# EAGLE design ESC Arduino Perm (1) (EAGLE 7.6.0)
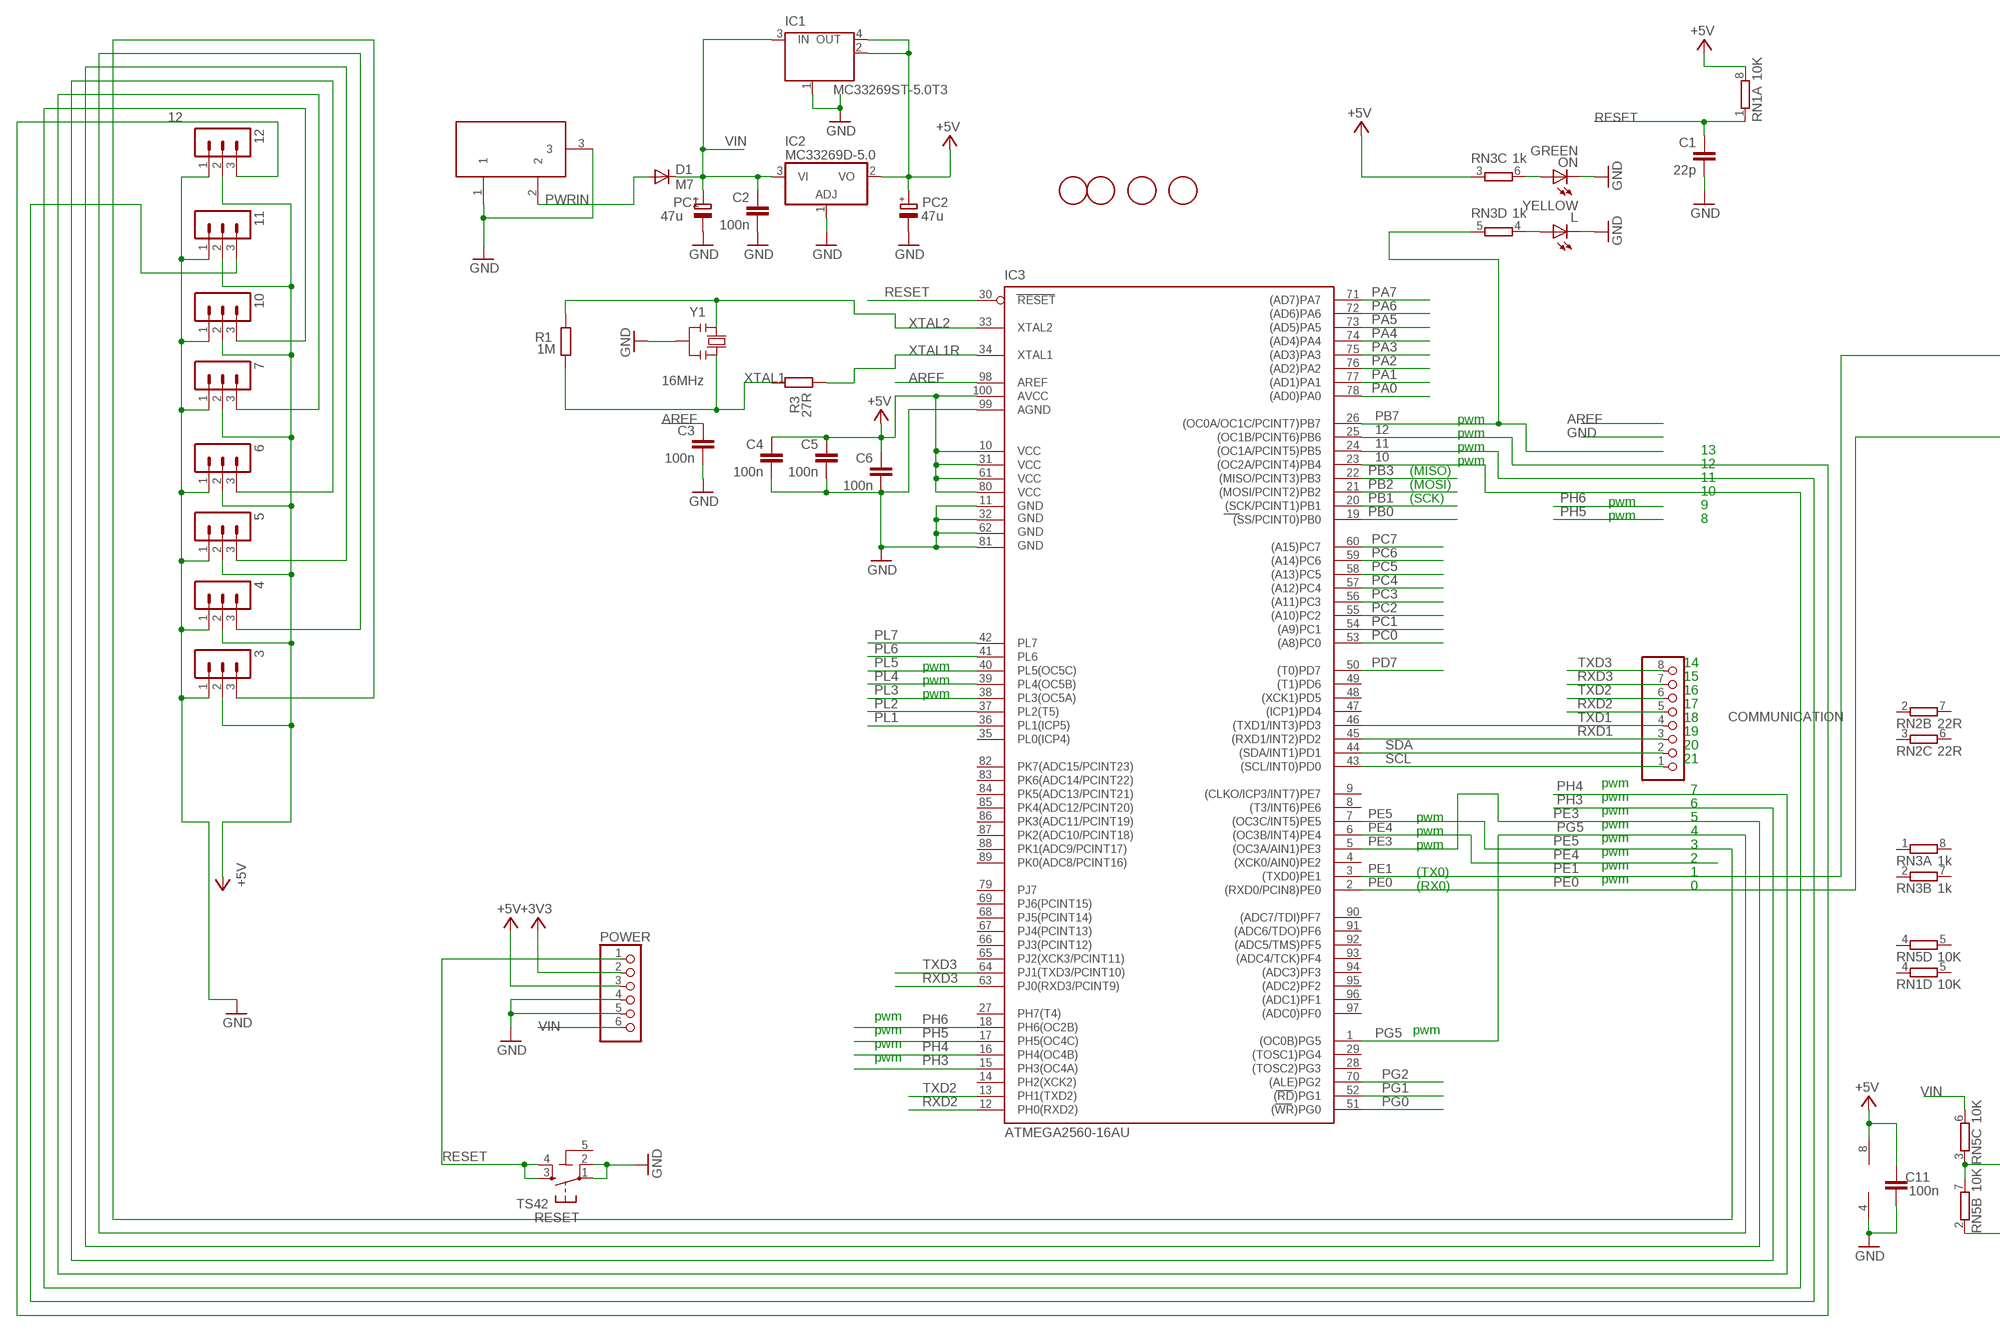
[diagram p0: schematic, sheet 1, part 1 of 2]
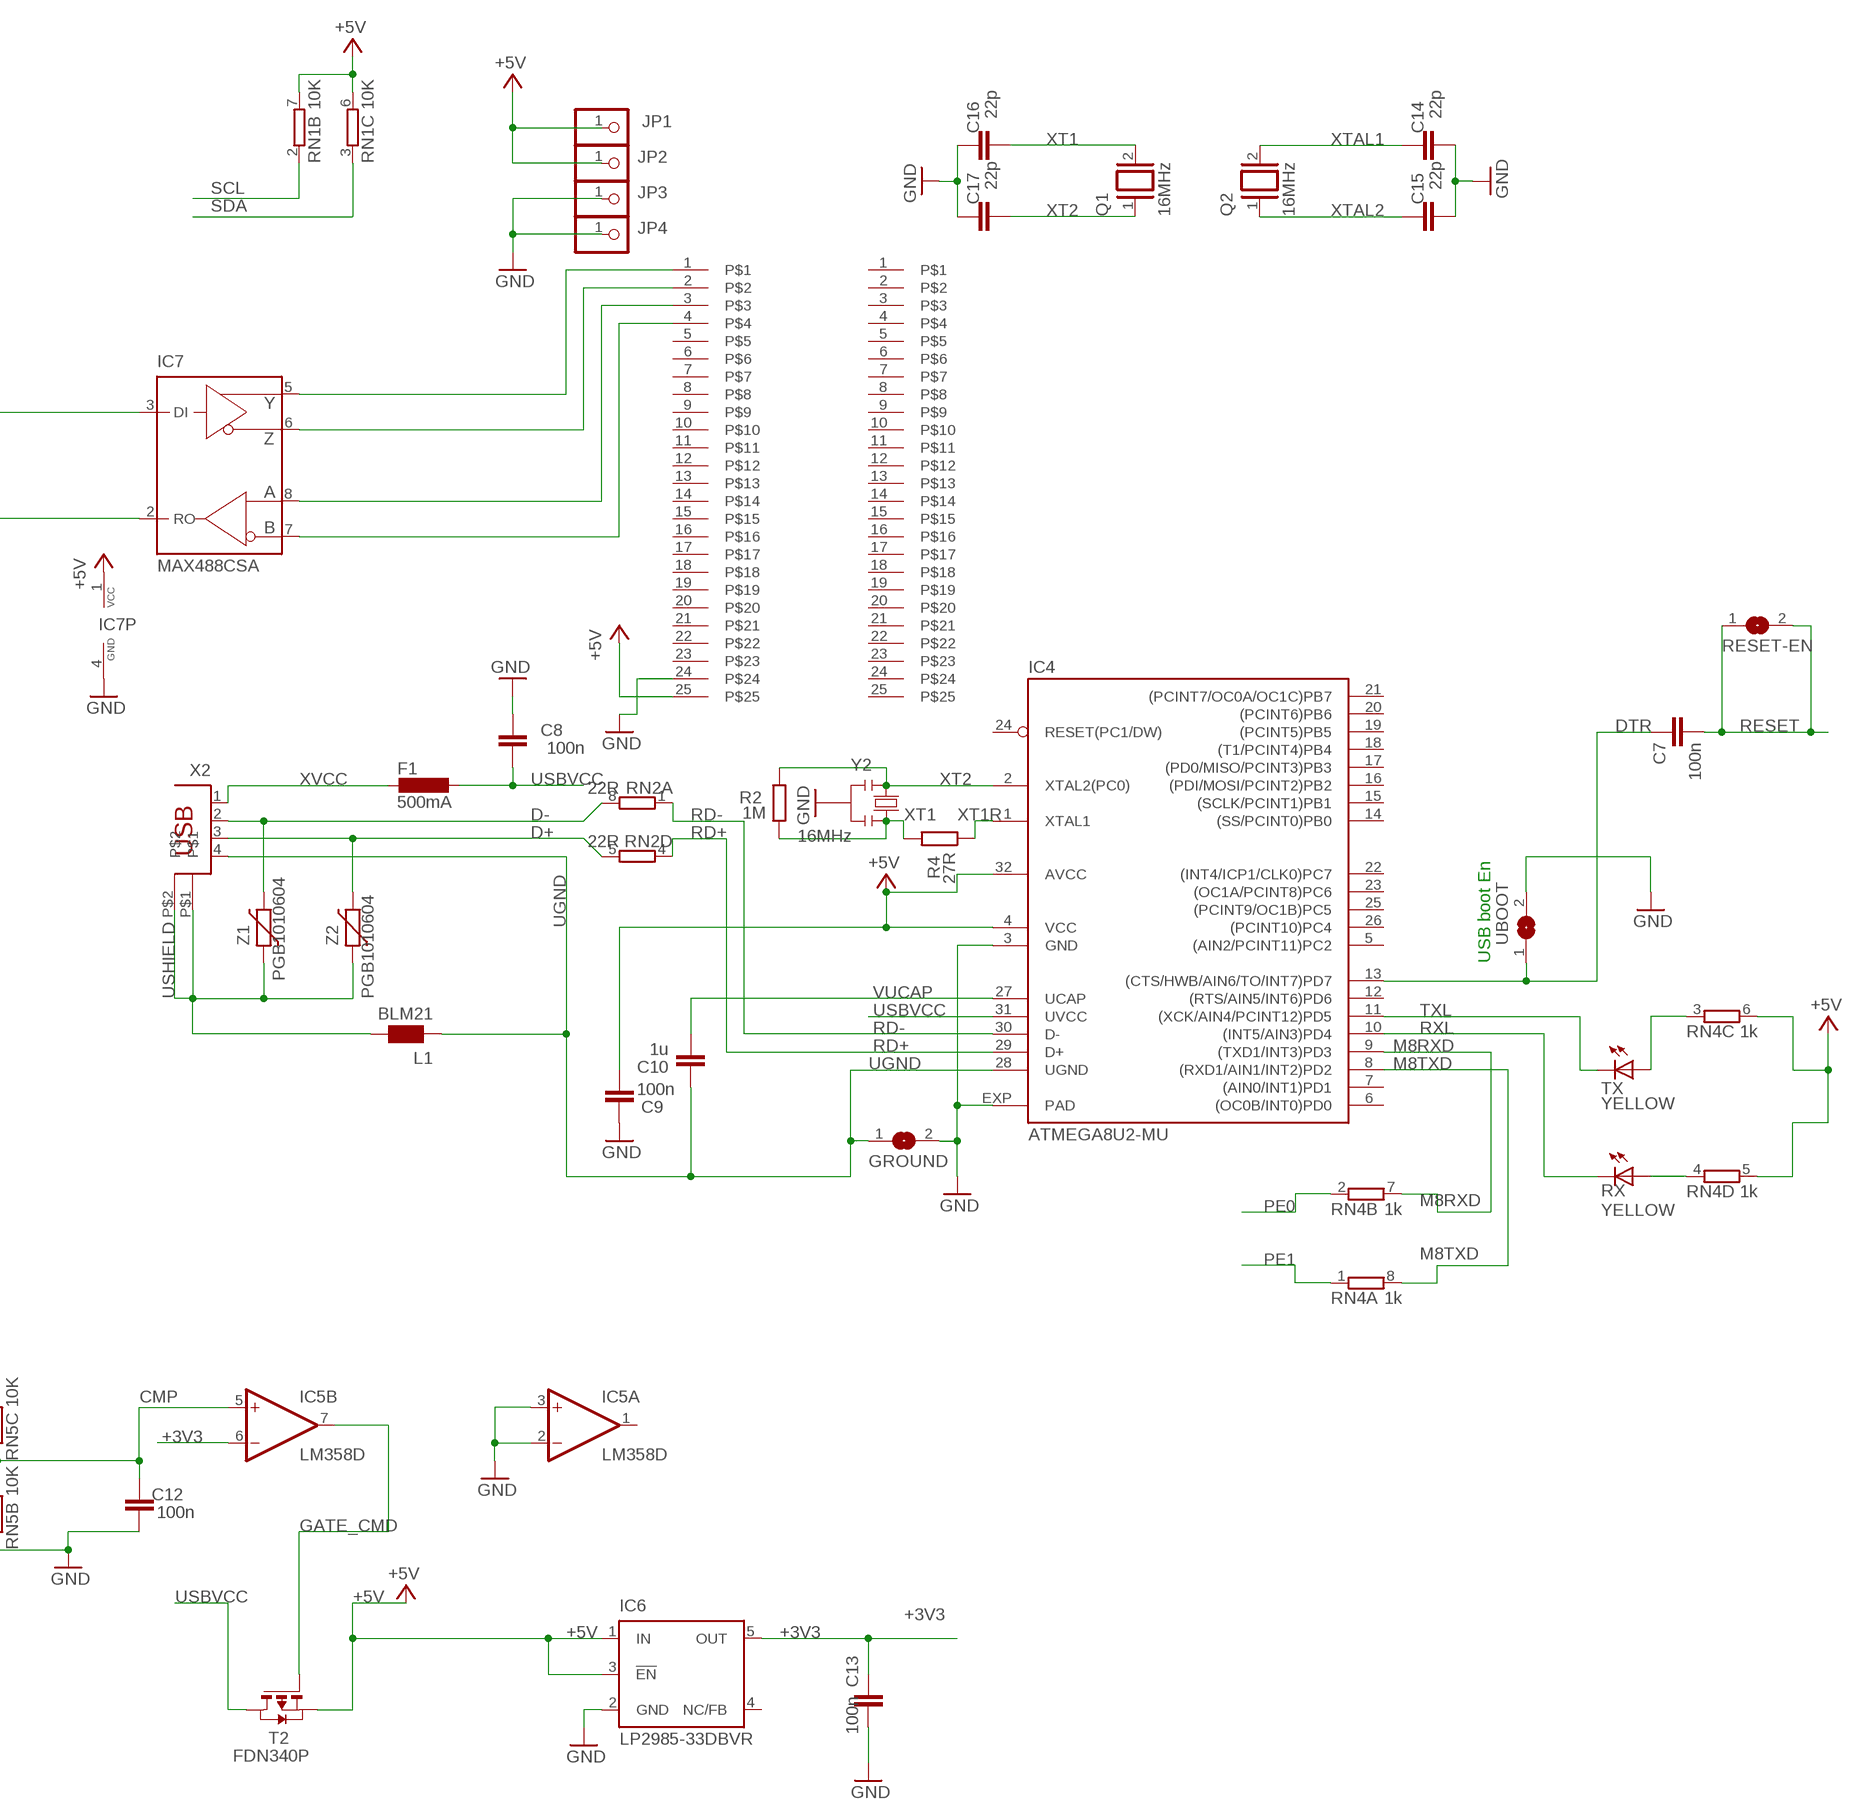
[diagram p1: schematic, sheet 1, part 2 of 2]

## Parts
3  MA03-1  [MA03-1]
4  MA03-1  [MA03-1]
5  MA03-1  [MA03-1]
6  MA03-1  [MA03-1]
7  MA03-1  [MA03-1]
10  MA03-1  [MA03-1]
11  MA03-1  [MA03-1]
12  MA03-1  [MA03-1]
C1  22p  C-EU0603-RND  [C0603-ROUND]
C2  100n  C-EU0603-RND  [C0603-ROUND]
C3  100n  C-EU0603-RND  [C0603-ROUND]
C4  100n  C-EU0603-RND  [C0603-ROUND]
C5  100n  C-EU0603-RND  [C0603-ROUND]
C6  100n  C-EU0603-RND  [C0603-ROUND]
C7  100n  C-EU0603-RND  [C0603-ROUND]
C8  100n  C-EUC0603  [C0603]
C9  100n  C-EU0603-RND  [C0603-ROUND]
C10  1u  C-EU0603-RND  [C0603-ROUND]
C11  100n  C-EUC0603  [C0603]
C12  100n  C-EU0603-RND  [C0603-ROUND]
C13  100n  C-EU0603-RND  [C0603-ROUND]
C14  22p  C-EU0603-RND  [C0603-ROUND]
C15  22p  C-EU0603-RND  [C0603-ROUND]
C16  22p  C-EU0603-RND  [C0603-ROUND]
C17  22p  C-EU0603-RND  [C0603-ROUND]
COMMUNICATION  PINHD-1X8  [1X08]
D1  M7  DIODE-SMB  [SMB]
F1  500mA  L-EUL1812  [L1812]
GROUND  SJ  [SJ]
IC1  MC33269ST-5.0T3  MC33269ST-3.3T3  [SOT223]
IC2  MC33269D-5.0  [DPACK]
IC3  ATMEGA2560-16AU  ATMEGA1280-16AU  [TQFP100]
IC4  ATMEGA8U2-MU  [QFN32]
IC5  LM358D  [SO08]
IC6  LP2985-33DBVR  TPS77033  [SOT23-DBV]
IC7  MAX488CSA  [SO08]
JP1  PINHD-1X1  [1X01]
JP2  PINHD-1X1  [1X01]
JP3  PINHD-1X1  [1X01]
JP4  PINHD-1X1  [1X01]
L  YELLOW  LEDCHIP-LED0805  [CHIP-LED0805]
L1  BLM21  WE-CBF_0805  [0805]
ON  GREEN  LEDCHIP-LED0805  [CHIP-LED0805]
PC1  47u  CPOL-EUD  [PANASONIC_D]
PC2  47u  CPOL-EUD  [PANASONIC_D]
POWER  PINHD-1X6  [1X06]
Q1  16MHz  XTAL/S  [QS]
Q2  16MHz  XTAL/S  [QS]
R1  1M  R-EU_R0603  [R0603-ROUND]
R2  1M  R-EU_R0603  [R0603-ROUND]
R3  27R  R-EU_R0603  [R0603-ROUND]
R4  27R  R-EU_R0603  [R0603-ROUND]
RESET  TS42  [TS42]
RESET-EN  SJ  [SJ]
RN1  10K  4R-NCAT16  [CAT16]
RN2  22R  4R-NCAY16  [CAY16]
RN3  1k  4R-NCAY16  [CAY16]
RN4  1k  4R-NCAY16  [CAY16]
RN5  10K  4R-NCAT16  [CAT16]
RX  YELLOW  LEDCHIP-LED0805  [CHIP-LED0805]
T2  FDN340P  PMOSSOT23  [SOT-23]
TX  YELLOW  LEDCHIP-LED0805  [CHIP-LED0805]
U$1  CARD-EDGE-LINEAR-ZIF  [CARD-EDGE]
U$2  FIDUCIALMOUNT  [FIDUCIA-MOUNT]
U$3  FIDUCIALMOUNT  [FIDUCIA-MOUNT]
U$4  FIDUCIALMOUNT  [FIDUCIA-MOUNT]
U$5  FIDUCIALMOUNT  [FIDUCIA-MOUNT]
U$6  CARD-EDGE-LINEAR-ZIF  [CARD-EDGE]
UBOOT  SJ  [SJ]
X1  DC21MMX  [DC-21MM]
X2  PN61729  [PN61729]
Y1  16MHz  RESONATORMU  [RESONATOR]
Y2  16MHz  RESONATORMU  [RESONATOR]
Z1  PGB1010604  VARISTORCN0603  [CT/CN0603]
Z2  PGB1010604  VARISTORCN0603  [CT/CN0603]

## Nets
10: 10.3 IC3.23((OC2A/PCINT4)PB4)
11: 11.3 IC3.24((OC1A/PCINT5)PB5)
12: 12.3 IC3.25((OC1B/PCINT6)PB6)
+3V3: C13.2 IC5.6(B:-IN) IC6.5(OUT) POWER.2
+5V: 3.2 4.2 5.2 6.2 7.2 10.2 11.2 12.2 C4.1 C5.1 C6.1 C9.1 C11.2 IC1.2(OUT) IC1.4(OUT) IC2.2(VO) IC3.10(VCC) IC3.31(VCC1) IC3.61(VCC2) IC3.80(VCC3) IC3.100(AVCC) IC4.4(VCC) IC4.32(AVCC) IC5.8(P:V+) IC6.1(IN) IC6.3(!EN) IC7.1(VCC) JP1.1 JP2.1 PC2.+ POWER.3 RN1.6 RN1.7 RN1.8 RN3.3 RN4.5 RN4.6 T2.2(S) U$1.25
AREF: C3.1 IC3.98(AREF)
CMP: C12.2 IC5.5(B:+IN) RN5.3 RN5.7
D+: RN2.5 X2.3 Z2.2
D-: RN2.8 X2.2 Z1.2
DTR: C7.1 IC4.13((CTS/HWB/AIN6/TO/INT7)PD7) UBOOT.1
GATE_CMD: IC5.7(B:OUT) T2.3(G)
GND: 3.1 4.1 5.1 6.1 7.1 10.1 11.1 12.1 C1.2 C2.2 C3.2 C4.2 C5.2 C6.2 C8.2 C9.2 C11.1 C12.1 C13.1 C14.1 C15.1 C16.2 C17.2 GROUND.2 IC1.1(GND/ADJ) IC2.1(ADJ) IC3.11(GND) IC3.32(GND1) IC3.62(GND2) IC3.81(GND3) IC3.99(AGND) IC4.3(GND) IC4.EXP(PAD) IC5.2(A:-IN) IC5.3(A:+IN) IC5.4(P:V-) IC6.2(GND) IC7.4(GND) JP3.1 JP4.1 L.C ON.C PC1.- PC2.- POWER.4 POWER.5 RESET.1 RESET.2 RN5.2 U$1.24 UBOOT.2 X1.1 X1.3 Y1.2 Y2.2
M8RXD: IC4.9((TXD1/INT3)PD3) RN4.7
M8TXD: IC4.8((RXD1/AIN1/INT2)PD2) RN4.8
N$2: L.A RN3.4
N$3: ON.A RN3.6
N$5: IC7.5(Y) U$1.1
N$6: IC7.6(Z) U$1.2
N$7: IC7.8(A) U$1.3
N$8: IC7.7(B) U$1.4
N$54: RN4.4 RX.A
N$55: RN4.3 TX.A
PA0: IC3.78((AD0)PA0)
PA1: IC3.77((AD1)PA1)
PA2: IC3.76((AD2)PA2)
PA3: IC3.75((AD3)PA3)
PA4: IC3.74((AD4)PA4)
PA5: IC3.73((AD5)PA5)
PA6: IC3.72((AD6)PA6)
PA7: IC3.71((AD7)PA7)
PB0: IC3.19((SS/PCINT0)PB0)
PB1: IC3.20((SCK/PCINT1)PB1)
PB2: IC3.21((MOSI/PCINT2)PB2)
PB3: IC3.22((MISO/PCINT3)PB3)
PB7: IC3.26((OC0A/OC1C/PCINT7)PB7) RN3.5
PC0: IC3.53((A8)PC0)
PC1: IC3.54((A9)PC1)
PC2: IC3.55((A10)PC2)
PC3: IC3.56((A11)PC3)
PC4: IC3.57((A12)PC4)
PC5: IC3.58((A13)PC5)
PC6: IC3.59((A14)PC6)
PC7: IC3.60((A15)PC7)
PD7: IC3.50((T0)PD7)
PE0: IC3.2((RXD0/PCIN8)PE0) IC7.2(RO) RN4.2
PE1: IC3.3((TXD0)PE1) IC7.3(DI) RN4.1
PE3: 5.3 IC3.5((OC3A/AIN1)PE3)
PE4: IC3.6((OC3B/INT4)PE4)
PE5: 3.3 IC3.7((OC3C/INT5)PE5)
PG0: IC3.51((WR)PG0)
PG1: IC3.52((RD)PG1)
PG2: IC3.70((ALE)PG2)
PG5: 4.3 IC3.1((OC0B)PG5)
PH3: 6.3 IC3.15(PH3(OC4A))
PH4: 7.3 IC3.16(PH4(OC4B))
PH5: IC3.17(PH5(OC4C))
PH6: IC3.18(PH6(OC2B))
PL1: IC3.36(PL1(ICP5))
PL2: IC3.37(PL2(T5))
PL3: IC3.38(PL3(OC5A))
PL4: IC3.39(PL4(OC5B))
PL5: IC3.40(PL5(OC5C))
PL6: IC3.41(PL6)
PL7: IC3.42(PL7)
PWRIN: D1.A X1.2
RD+: IC4.29(D+) RN2.4
RD-: IC4.30(D-) RN2.1
RESET: C1.1 C7.2 IC3.30(RESET) POWER.1 RESET-EN.1 RESET-EN.2 RESET.3 RESET.4 RN1.1
RXD1: COMMUNICATION.3 IC3.45((RXD1/INT2)PD2)
RXD2: COMMUNICATION.5 IC3.12(PH0(RXD2))
RXD3: COMMUNICATION.7 IC3.63(PJ0(RXD3/PCINT9))
RXL: IC4.10((INT5/AIN3)PD4) RX.C
SCL: COMMUNICATION.1 IC3.43((SCL/INT0)PD0) RN1.2
SDA: COMMUNICATION.2 IC3.44((SDA/INT1)PD1) RN1.3
TXD1: COMMUNICATION.4 IC3.46((TXD1/INT3)PD3)
TXD2: COMMUNICATION.6 IC3.13(PH1(TXD2))
TXD3: COMMUNICATION.8 IC3.64(PJ1(TXD3/PCINT10))
TXL: IC4.11((XCK/AIN4/PCINT12)PD5) TX.C
UGND: C10.2 GROUND.1 IC4.28(UGND) L1.1 X2.4
USBVCC: C8.1 F1.1 IC4.31(UVCC) T2.1(D)
USHIELD: L1.2 X2.P$1 X2.P$2 Z1.1 Z2.1
VIN: C2.1 D1.C IC1.3(IN) IC2.3(VI) PC1.+ POWER.6 RN5.6
VUCAP: C10.1 IC4.27(UCAP)
XT1: C16.1 Q1.2 R2.1 R4.2 Y2.3
XT1R: IC4.1(XTAL1) R4.1
XT2: C17.1 IC4.2(XTAL2(PC0)) Q1.1 R2.2 Y2.1
XTAL1: C14.2 Q2.2 R1.1 R3.2 Y1.3
XTAL1R: IC3.34(XTAL1) R3.1
XTAL2: C15.2 IC3.33(XTAL2) Q2.1 R1.2 Y1.1
XVCC: F1.2 X2.1
Unconnected: IC3.4((XCK0/AIN0)PE2) IC3.8((T3/INT6)PE6) IC3.9((CLKO/ICP3/INT7)PE7) IC3.14(PH2(XCK2)) IC3.27(PH7(T4)) IC3.28((TOSC2)PG3) IC3.29((TOSC1)PG4) IC3.35(PL0(ICP4)) IC3.47((ICP1)PD4) IC3.48((XCK1)PD5) IC3.49((T1)PD6) IC3.65(PJ2(XCK3/PCINT11)) IC3.66(PJ3(PCINT12)) IC3.67(PJ4(PCINT13)) IC3.68(PJ5(PCINT14)) IC3.69(PJ6(PCINT15)) IC3.79(PJ7) IC3.82(PK7(ADC15/PCINT23)) IC3.83(PK6(ADC14/PCINT22)) IC3.84(PK5(ADC13/PCINT21)) IC3.85(PK4(ADC12/PCINT20)) IC3.86(PK3(ADC11/PCINT19)) IC3.87(PK2(ADC10/PCINT18)) IC3.88(PK1(ADC9/PCINT17)) IC3.89(PK0(ADC8/PCINT16)) IC3.90((ADC7/TDI)PF7) IC3.91((ADC6/TDO)PF6) IC3.92((ADC5/TMS)PF5) IC3.93((ADC4/TCK)PF4) IC3.94((ADC3)PF3) IC3.95((ADC2)PF2) IC3.96((ADC1)PF1) IC3.97((ADC0)PF0) IC4.5((AIN2/PCINT11)PC2) IC4.6((OC0B/INT0)PD0) IC4.7((AIN0/INT1)PD1) IC4.12((RTS/AIN5/INT6)PD6) IC4.14((SS/PCINT0)PB0) IC4.15((SCLK/PCINT1)PB1) IC4.16((PDI/MOSI/PCINT2)PB2) IC4.17((PD0/MISO/PCINT3)PB3) IC4.18((T1/PCINT4)PB4) IC4.19((PCINT5)PB5) IC4.20((PCINT6)PB6) IC4.21((PCINT7/OC0A/OC1C)PB7) IC4.22((INT4/ICP1/CLK0)PC7) IC4.23((OC1A/PCINT8)PC6) IC4.24(RESET(PC1/DW)) IC4.25((PCINT9/OC1B)PC5) IC4.26((PCINT10)PC4) IC5.1(A:OUT) IC6.4(NC/FB) RN1.4 RN1.5 RN2.2 RN2.3 RN2.6 RN2.7 RN3.1 RN3.2 RN3.7 RN3.8 RN5.1 RN5.4 RN5.5 RN5.8 U$1.5 U$1.6 U$1.7 U$1.8 U$1.9 U$1.10 U$1.11 U$1.12 U$1.13 U$1.14 U$1.15 U$1.16 U$1.17 U$1.18 U$1.19 U$1.20 U$1.21 U$1.22 U$1.23 U$6.1 U$6.2 U$6.3 U$6.4 U$6.5 U$6.6 U$6.7 U$6.8 U$6.9 U$6.10 U$6.11 U$6.12 U$6.13 U$6.14 U$6.15 U$6.16 U$6.17 U$6.18 U$6.19 U$6.20 U$6.21 U$6.22 U$6.23 U$6.24 U$6.25

## Notes on the sheet
- pwm
- pwm
- pwm | 13
- pwm | 12
- (MISO)
- 11
- (MOSI)
- 10
- (SCK) | pwm
- 9
- pwm | 8
- pwm | 14
- pwm | 15
- pwm | 16
- 17
- 18
- 19
- 20
- 21
- USB boot En
- pwm
- 7
- pwm
- 6
- pwm
- pwm | 5
- pwm
- pwm | 4
- pwm
- pwm | 3
- pwm
- 2
- pwm
- (TX0) | 1
- pwm
- (RX0) | 0
- pwm
- pwm | pwm
- pwm
- pwm

## Power pins joined to a net without a drawn wire
5-GND: RESET.5(5-GND)

## Library data of the parts
3-7 10-12 = con-lstb:MA03-1: PIN HEADER; OC_FARNELL: unknown; OC_NEWARK: unknown
C1-C7 C9 C10 C12-C17 = SmartPrj:C-EU: CAPACITOR, European symbol
C8 C11 = rcl:C-EU: CAPACITOR, European symbol
COMMUNICATION = pinhead:PINHD-1X8: PIN HEADER
D1 = diode:DIODE-: DIODE
F1 = rcl:L-EU: INDUCTOR, European symbol
GROUND RESET-EN UBOOT = jumper:SJ: SMD solder JUMPER
IC1 = linear:MC33269ST*: Adjustable Output Low Dropout Voltage Regulator 800 mA Source: http://www.onsemi.com/pub/Collateral/MC33269-D.PDF
IC2 = linear:MC33269?*: Adjustable Output Low Dropout Voltage Regulator 800 mA Source: http://www.onsemi.com/pub/Collateral/MC33269-D.PDF
IC3 = atmel-2005:ATMEGA*: MICROCONTROLLER 64/128/256 Kbytes FLASH 4 Kbytes EEPROM 8 Kbytes SRAM 86 General Purpose I/O pins 12-channels16-bit PWM 4 x Serial USARTs 16-channels 10-bit A/D
IC4 = atmel:ATMEGA8U2-MU
IC5 = linear:LM358: OP AMP also LM158; LM258; LM2904 Source: http://cache.national.com/ds/LM/LM158.pdf
IC6 = texas:TPS770*: ULTRALOW-POWER 50-mA LOW-DROPOUT LINEAR REGULATORS 50-mA Low-Dropout Regulator Source: http://focus.ti.com/lit/ds/symlink/tps77001.pdf
IC7 = maxim:MAX488: RS485 TRANSEIVER Source: Data sheet <http://datasheets.maxim-ic.com/en/ds/MAX1487-MAX491.pdf>; MF: MAXIM; MPN: MAX488CSA; OC_FARNELL: 3534170; OC_NEWARK: 34C3921
JP1-JP4 = pinhead:PINHD-1X1: PIN HEADER
L ON RX TX = led:LED: LED OSRAM: - CHIPLED LG R971, LG N971, LY N971, LG Q971, LY Q971, LO R971, LY R971 LH N974, LH R974 LS Q976, LO Q976, LY Q976 LO Q996 - Hyper CHIPLED LW Q18S LB Q993, LB Q99A, LB R99A - SideLED LS A670, LO A670, LY A670, LG A670, LP A670 LB A673, LV A673, LT A673, LW A673 LH A674 LY A675 LS A676, LA A676, LO A676, LY A676, LW A676 LS A679, LY A679, LG A679 - Hyper Micro SIDELED® LS Y876, LA Y876, LO Y876, LY Y876 LT Y87S - SmartLED LW L88C, LW L88S LB L89C, LB L89S, LG L890 LS L89K, LO L89K, LY L89K LS L896, LA L896, LO L896, LY L896 - TOPLED LS T670, LO T670, LY T670, LG T670, LP T670 LSG T670, LSP T670, LSY T670, LOP T670, LYG T670 LG T671, LOG T671, LSG T671 LB T673, LV T673, LT T673, LW T673 LH T674 LS T676, LA T676, LO T676, LY T676, LB T676, LH T676, LSB T676, LW T676 LB T67C, LV T67C, LT T67C, LS T67K, LO T67K, LY T67K, LW E67C LS E67B, LA E67B, LO E67B, LY E67B, LB E67C, LV E67C, LT E67C LW T67C LS T679, LY T679, LG T679 LS T770, LO T770, LY T770, LG T770, LP T770 LB T773, LV T773, LT T773, LW T773 LH T774 LS E675, LA E675, LY E675, LS T675 LS T776, LA T776, LO T776, LY T776, LB T776 LHGB T686 LT T68C, LB T68C - Hyper Mini TOPLED® LB M676 - Mini TOPLED Santana® LG M470 LS M47K, LO M47K, LY M47K Source: http://www.osram.convergy.de LUXEON: - LUMILED® LXK2-PW12-R00, LXK2-PW12-S00, LXK2-PW14-U00, LXK2-PW14-V00 LXK2-PM12-R00, LXK2-PM12-S00, LXK2-PM14-U00 LXK2-PE12-Q00, LXK2-PE12-R00, LXK2-PE12-S00, LXK2-PE14-T00, LXK2-PE14-U00 LXK2-PB12-K00, LXK2-PB12-L00, LXK2-PB12-M00, LXK2-PB14-N00, LXK2-PB14-P00, LXK2-PB14-Q00 LXK2-PR12-L00, LXK2-PR12-M00, LXK2-PR14-Q00, LXK2-PR14-R00 LXK2-PD12-Q00, LXK2-PD12-R00, LXK2-PD12-S00 LXK2-PH12-R00, LXK2-PH12-S00 LXK2-PL12-P00, LXK2-PL12-Q00, LXK2-PL12-R00 Source: www.luxeon.com KINGBRIGHT: KA-3528ASYC Source: www.kingbright.com
L1 = wuerth-elektronik:WE-CBF: SMD EMI Suppression Ferrite Beads - excellent anti-EMI properties - low DCR - impedances till 3000 ohms - rated current up to 6 A
PC1 PC2 = rcl:CPOL-EU: POLARIZED CAPACITOR, European symbol
POWER = pinhead:PINHD-1X6: PIN HEADER
Q1 Q2 = special:XTAL/S: CRYSTAL
R1-R4 = SmartPrj:R-EU_: RESISTOR, European symbol
RESET = st-mod v1.4:TS42: TS42 Dongnan Electronics Tact switch VDC 12V - 50mA
RN1-RN5 = resistor-dil:4R-N: Array Chip Resistor Source: RS Component / Phycomp
T2 = zetex:PMOSSOT23: MOS FET
U$1 U$6 = card-edge-linearzif:CARD-EDGE-LINEAR-ZIF
U$2-U$5 = SmartPrj:FIDUCIALMOUNT
X1 = powersupply:DC21MM
X2 = SmartPrj:PN61729: BERG USB connector
Y1 Y2 = SmartPrj:RESONATOR
Z1 Z2 = varistor:VARISTOR: VARISTOR

## Net classes
0 default: width 0.15 mm, drill 0.3 mm, clearance 0.15 mm

## Board
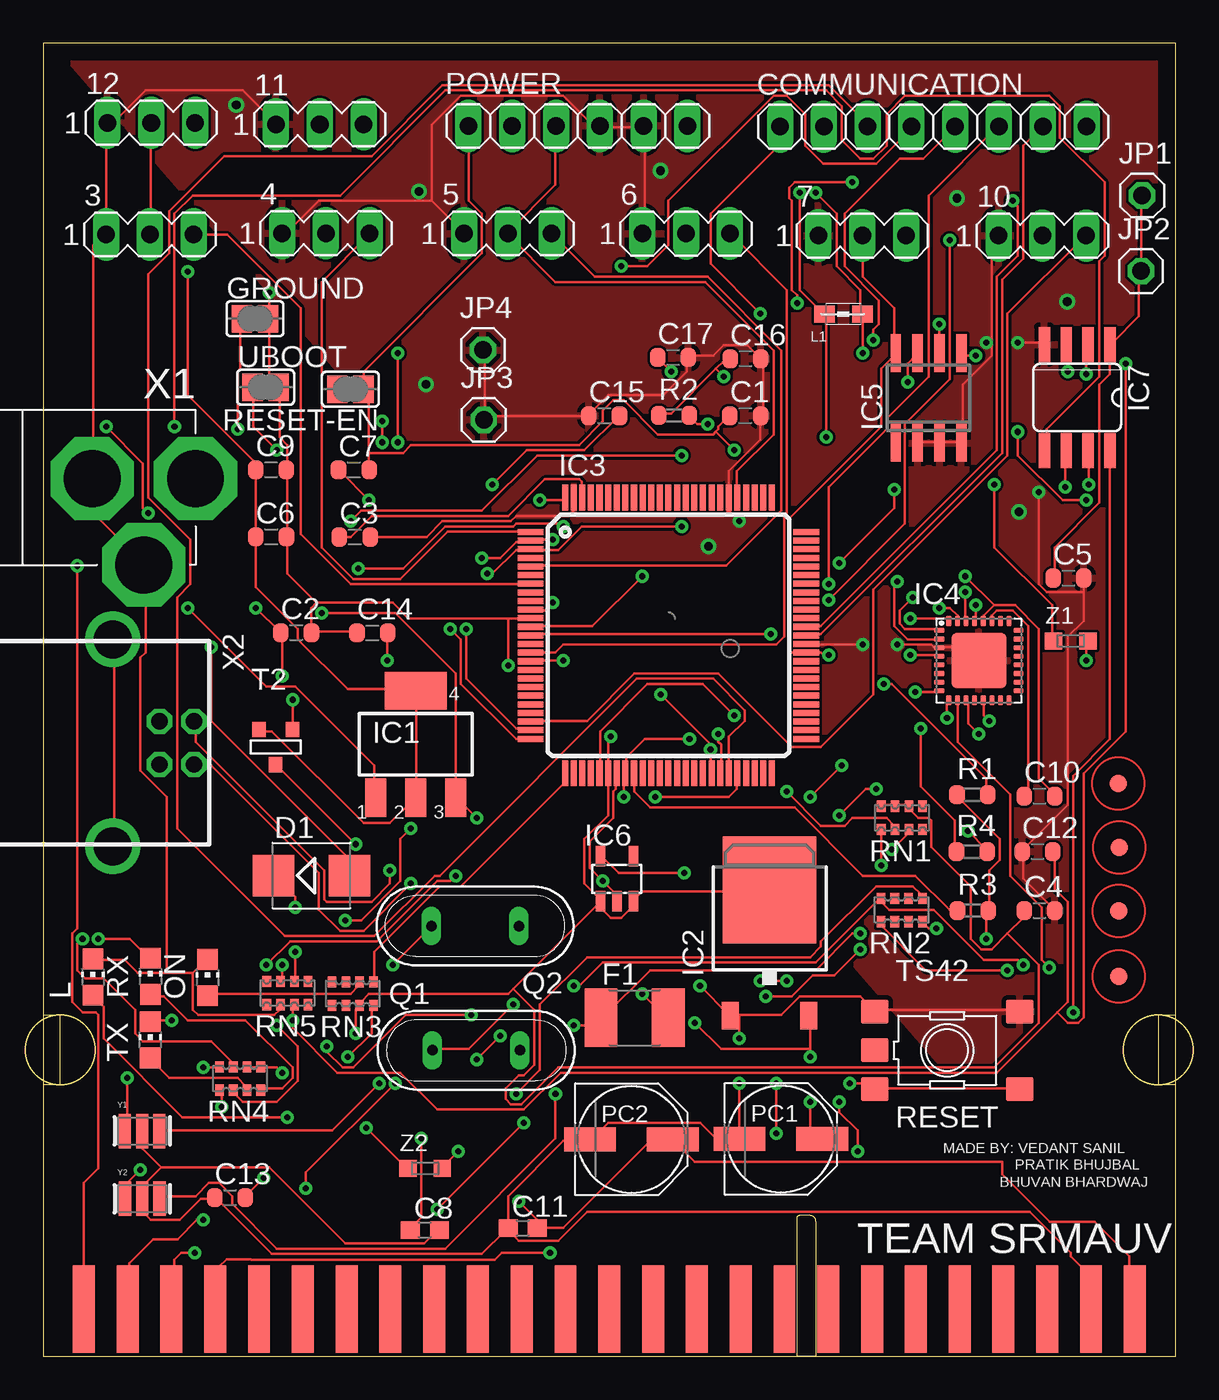
[diagram p2: board, top side]
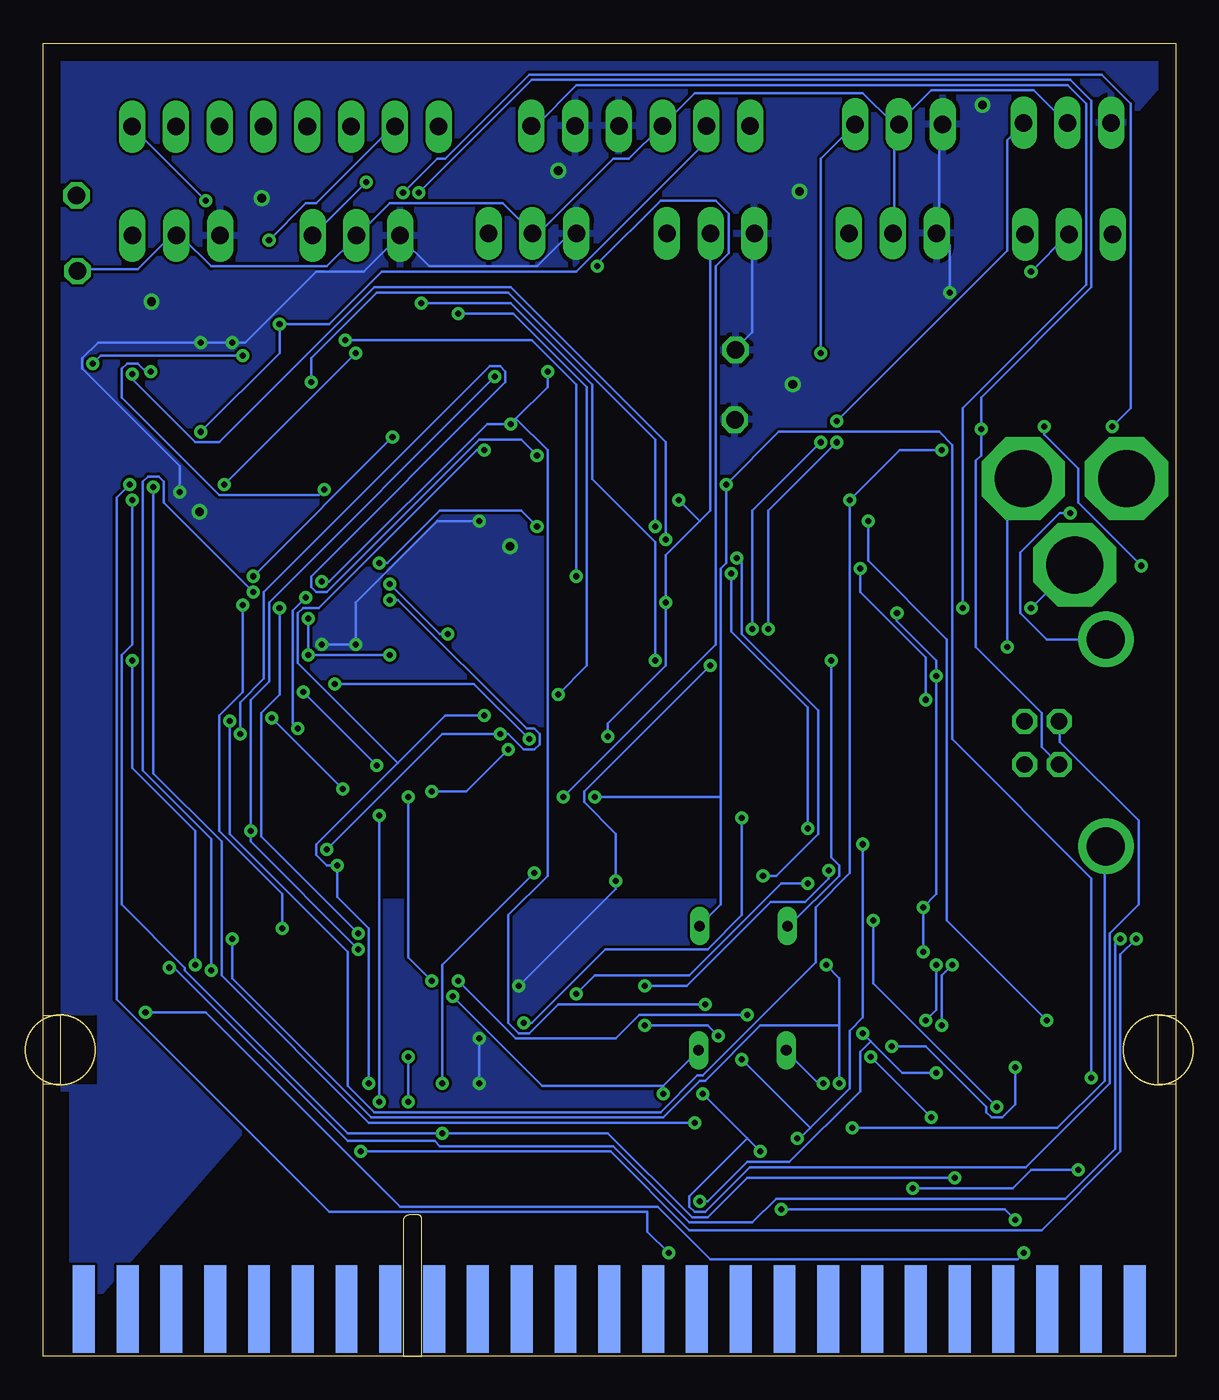
[diagram p3: board, bottom side, seen from below]

Size 65.68 x 76.2 mm. Coordinates in mm from the lower left corner, seen from the top.
Outline: 0,0 65.68,0 65.68,76.2 0,76.2 0,0
Copper layers (1*16): Top 0.035mm / dielectric 1.5mm / Bottom 0.035mm
Design rules "default *": minimum track width 4mil, minimum drill 0.35mm, track to track 6mil, track to pad 0.5mil, pad to pad 5mil, via to via 6mil, smd to smd 0.5mil, copper to edge 40mil, drill to drill 6mil, minimum pad ring 10mil, minimum via ring 8mil, stop-mask expansion 4mil, vias tented up to drill 0mil, thermal gap 10mil
bKeepout: area 0,0 to 1.5,5.1; area 64.2,0 to 65.7,5.1
tRestrict: area 0,0 to 1.5,15.2; area 64.2,0 to 65.8,15.6; area 0,15.8 to 3,19.8; area 62.6,16 to 65.8,19.8
bRestrict: area 0.1,0 to 1.5,15.2; area 64.2,0 to 65.7,15.3; area 0,15.8 to 3,19.8; area 62.6,15.8 to 65.8,19.8; area 43.8,0 to 44.8,8.2
Milling: area -1,15.8 to 3,19.8; area 62.7,15.8 to 66.7,19.8; area 64.7,15.8 to 65.7,19.8; area 0,15.8 to 1,19.8; area 43.7,0 to 44.8,8.2

### Footprints (pad centres in the part's own frame; a part is rotated, then mirrored left to right if it is on the bottom)
MA03-1 = drill 1.016 long: 1 -2.54,0; 2 0,0; 3 2.54,0
C0603-ROUND = smd 0.898 x 1.1: 1 -0.889,0; 2 0.889,0
C0603 = smd 1.1 x 1: 1 -0.85,0; 2 0.85,0
1X08 = drill 1.016 long: 1 -8.89,0; 2 -6.35,0; 3 -3.81,0; 4 -1.27,0; 5 1.27,0; 6 3.81,0; 7 6.35,0; 8 8.89,0
SMB = smd 2.4 x 2.4: A 2.2,0; C -2.2,0
L1812 = smd 1.9 x 3.4: 1 -1.95,0; 2 1.95,0
SJ = smd 1.168 x 1.6: 1 -0.762,0; 2 0.762,0
SOT223 = smd 1.219 x 2.235: 1 -2.311,-3.099; 2 0,-3.099; 3 2.311,-3.099 | smd 3.6 x 2.2: 4 0,3.099
DPACK = smd 1 x 1.6: 1 -2.28,-4.8; 3 2.28,-4.8 | smd 5.4 x 6.2: 2 0,2.5
TQFP100 = smd 1.5 x 0.35: 1 -8,6; 2 -8,5.5; 3 -8,5; 4 -8,4.5; 5 -8,4; 6 -8,3.5; 7 -8,3; 8 -8,2.5; 9 -8,2; 10 -8,1.5; 11 -8,1; 12 -8,0.5; 13 -8,0; 14 -8,-0.5; 15 -8,-1; 16 -8,-1.5; 17 -8,-2; 18 -8,-2.5; 19 -8,-3; 20 -8,-3.5; 21 -8,-4; 22 -8,-4.5; 23 -8,-5; 24 -8,-5.5; 25 -8,-6; 51 8,-6; 52 8,-5.5; 53 8,-5; 54 8,-4.5; 55 8,-4; 56 8,-3.5; 57 8,-3; 58 8,-2.5; 59 8,-2; 60 8,-1.5; 61 8,-1; 62 8,-0.5; 63 8,0; 64 8,0.5; 65 8,1; 66 8,1.5; 67 8,2; 68 8,2.5; 69 8,3; 70 8,3.5; 71 8,4; 72 8,4.5; 73 8,5; 74 8,5.5; 75 8,6 | smd 0.35 x 1.5: 26 -6,-8; 27 -5.5,-8; 28 -5,-8; 29 -4.5,-8; 30 -4,-8; 31 -3.5,-8; 32 -3,-8; 33 -2.5,-8; 34 -2,-8; 35 -1.5,-8; 36 -1,-8; 37 -0.5,-8; 38 0,-8; 39 0.5,-8; 40 1,-8; 41 1.5,-8; 42 2,-8; 43 2.5,-8; 44 3,-8; 45 3.5,-8; 46 4,-8; 47 4.5,-8; 48 5,-8; 49 5.5,-8; 50 6,-8; 76 6,8; 77 5.5,8; 78 5,8; 79 4.5,8; 80 4,8; 81 3.5,8; 82 3,8; 83 2.5,8; 84 2,8; 85 1.5,8; 86 1,8; 87 0.5,8; 88 0,8; 89 -0.5,8; 90 -1,8; 91 -1.5,8; 92 -2,8; 93 -2.5,8; 94 -3,8; 95 -3.5,8; 96 -4,8; 97 -4.5,8; 98 -5,8; 99 -5.5,8; 100 -6,8
QFN32 = smd 0.6 x 0.3: 1 -2.3,1.75; 2 -2.3,1.25; 3 -2.3,0.75; 4 -2.3,0.25; 5 -2.3,-0.25; 6 -2.3,-0.75; 7 -2.3,-1.25; 8 -2.3,-1.75; 17 2.3,-1.75; 18 2.3,-1.25; 19 2.3,-0.75; 20 2.3,-0.25; 21 2.3,0.25; 22 2.3,0.75; 23 2.3,1.25; 24 2.3,1.75 | smd 0.3 x 0.6: 9 -1.75,-2.3; 10 -1.25,-2.3; 11 -0.75,-2.3; 12 -0.25,-2.3; 13 0.25,-2.3; 14 0.75,-2.3; 15 1.25,-2.3; 16 1.75,-2.3; 25 1.75,2.3; 26 1.25,2.3; 27 0.75,2.3; 28 0.25,2.3; 29 -0.25,2.3; 30 -0.75,2.3; 31 -1.25,2.3; 32 -1.75,2.3 | smd 3.2 x 3.2: EXP 0,0
SO08 = smd 0.6 x 2.2: 1 -1.905,-2.6; 2 -0.635,-2.6; 3 0.635,-2.6; 4 1.905,-2.6; 5 1.905,2.6; 6 0.635,2.6; 7 -0.635,2.6; 8 -1.905,2.6
SOT23-DBV = smd 0.55 x 1.2: 1 -0.95,-1.3; 2 0,-1.3; 3 0.95,-1.3; 4 0.95,1.3; 5 -0.95,1.3
SO08' = smd 0.66 x 2.032: 1 -1.905,-3.073; 2 -0.635,-3.073; 3 0.635,-3.073; 4 1.905,-3.073; 5 1.905,3.073; 6 0.635,3.073; 7 -0.635,3.073; 8 -1.905,3.073
1X01 = drill 1.016 octagon: 1 0,0
CHIP-LED0805 = smd 1.2 x 1.2: A 0,-1.05; C 0,1.05
0805 = smd 1.2 x 1: 1 -1.1,0; 2 1.1,0
PANASONIC_D = smd 3 x 1.4: + 2.4,0; - -2.4,0
1X06 = drill 1.016 long: 1 -6.35,0; 2 -3.81,0; 3 -1.27,0; 4 1.27,0; 5 3.81,0; 6 6.35,0
QS = drill 0.61 long: 1 -2.54,0; 2 2.54,0
R0603-ROUND = smd 0.898 x 1.1: 1 -0.889,0; 2 0.889,0
TS42 = smd 1.6 x 1.4: 1 -4.2,2.25; 2 4.2,2.25; 3 -4.2,-2.25; 4 4.2,-2.25; 5 -4.2,0
CAT16 = smd 0.5 x 0.65: 1 -1.2,-0.675; 2 -0.4,-0.675; 3 0.4,-0.675; 4 1.2,-0.675; 5 1.2,0.675; 6 0.4,0.675; 7 -0.4,0.675; 8 -1.2,0.675
CAY16 = smd 0.5 x 0.65: 1 -1.2,-0.675; 2 -0.4,-0.675; 3 0.4,-0.675; 4 1.2,-0.675; 5 1.2,0.675; 6 0.4,0.675; 7 -0.4,0.675; 8 -1.2,0.675
SOT-23 = smd 0.787 x 0.889: 1 0.025,-1.016; 2 -0.94,1.016; 3 0.991,1.016
CARD-EDGE = smd 1.27 x 5.08: 1 -30.48,2.54; 2 -27.94,2.54; 3 -25.4,2.54; 4 -22.86,2.54; 5 -20.32,2.54; 6 -17.78,2.54; 7 -15.24,2.54; 8 -12.7,2.54; 9 -10.16,2.54; 10 -7.62,2.54; 11 -5.08,2.54; 12 -2.54,2.54; 13 0,2.54; 14 2.54,2.54; 15 5.08,2.54; 16 7.62,2.54; 17 10.16,2.54; 18 12.7,2.54; 19 15.24,2.54; 20 17.78,2.54; 21 20.32,2.54; 22 22.86,2.54; 23 25.4,2.54; 24 27.94,2.54; 25 30.48,2.54
FIDUCIA-MOUNT = smd 1.016 x 1.016: P$1 0,0
DC-21MM = drill 3.302 pad 4.826 octagon: 1 -5.08,-3.353; 2 -0.076,-6.35; 3 -0.076,-0.356
PN61729 = drill 0.95 octagon: 1 1.25,4.71; 2 -1.25,4.71; 3 -1.25,2.71; 4 1.25,2.71 | drill 2.2: P$1 -6,0; P$2 6,0
RESONATOR = smd 0.7 x 2: 1 -1,0; 2 0,0; 3 1,0
CT/CN0603 = smd 1 x 1: 1 -1,0; 2 1,0

### Placement (x,y rotation side)
3  6.19,65.1 0 top
4  16.4,65.17 0 top
5  26.96,65.15 0 top
6  37.3,65.15 0 top
7  47.51,65.03 0 top
10  57.96,65.03 0 top
11  16.05,71.49 0 top
12  6.27,71.58 0 top
C1  40.73,54.58 0 top
C2  14.68,41.99 0 top
C3  18.08,47.54 0 top
C4  57.79,25.87 0 top
C5  59.47,45.16 0 top
C6  13.23,47.54 0 top
C7  18.02,51.43 0 top
C8  22.14,7.34 0 top
C9  13.22,51.45 0 top
C10  57.79,32.51 0 top
C11  27.82,7.44 0 top
C12  57.67,29.29 0 top
C13  10.83,9.21 0 top
C14  19.1,41.97 0 top
C15  32.54,54.58 0 top
C16  40.73,57.88 0 top
C17  36.53,57.96 0 top
COMMUNICATION  51.63,71.35 0 top
D1  15.57,27.9 0 top
F1  34.3,19.65 0 top
GROUND  12.29,60.21 0 top
IC1  21.62,35.52 0 top
IC2  42.13,24.57 0 top
IC3  36.27,41.83 0 top
IC4  54.28,40.37 0 top
IC5  51.36,55.61 0 top
IC6  33.28,27.71 0 top
IC7  MAX488CSA  [SO08']  59.98,55.63 180 top
JP1  63.74,67.36 0 top
JP2  63.68,62.97 0 top
JP3  25.56,54.34 0 top
JP4  25.51,58.4 0 top
L  2.89,22.02 0 top
L1  46.42,60.48 0 top
ON  9.53,21.98 0 top
PC1  42.79,12.62 0 top
PC2  34.11,12.6 0 top
POWER  31.02,71.4 0 top
Q1  25.12,17.76 0 top
Q2  25.06,24.97 180 top
R1  53.9,32.58 0 top
R2  36.59,54.59 0 top
R3  53.93,25.87 0 top
R4  53.86,29.29 0 top
RESET  52.44,17.76 0 top
RESET-EN  17.82,56.12 180 top
RN1  49.82,31.25 0 top
RN2  49.79,25.9 0 top
RN3  17.96,21.05 0 top
RN4  11.43,16.13 0 top
RN5  14.17,21.09 0 top
RX  6.22,22.06 0 top
T2  13.46,35.35 0 top
TX  6.21,18.38 0 top
U$1  32.84,0.2 0 top
U$2  62.39,22.04 0 top
U$3  62.38,25.84 0 top
U$4  62.42,29.53 0 top
U$5  62.36,33.24 0 top
U$6  32.84,0.2 0 bottom
UBOOT  12.91,56.23 0 top
X1  2.49,51.01 90 top
X2  4.04,35.6 270 top
Y1  5.75,13.08 0 top
Y2  5.75,9.15 0 top
Z1  59.6,41.51 0 top
Z2  22.16,10.91 0 top

### Tracks (layer width: path | path; a pad name or v marks a point on that pad's centre or on a via)
10
  Top 0.152: IC3.23 28.35,36.88 31.55,36.88 34.29,39.62 39.17,39.62 43.43,35.36 45.11,35.36 48.16,38.41 48.16,44.5 55.93,52.27 55.93,60.5 60.35,64.92 10.3
11  (via drill 0.35)
  Top 0.152: v24.54,42.22 24.54,39.32 27.43,36.42 28.19,36.42 IC3.24 | v20.57,58.22 v20.57,53.03
  Bottom 0.152: v24.54,42.22 24.54,49.07 v20.57,53.03 | v20.57,58.22 20.57,69.49 18.59,71.48 11.3
12  (via drill 0.35)
  Top 0.152: v23.62,42.22 24.23,41.6 24.23,39.01 27.43,35.81 28.19,35.81 IC3.25 | v19.66,54.25 v19.66,53.03
  Bottom 0.152: v23.62,42.22 23.62,49.07 v19.66,53.03 | v19.66,54.25 9.75,64.16 9.75,70.56 8.84,71.48 12.3
+3V3  (via drill 0.35)
  Top 0.152: v51.97,59.89 51.97,58.22 IC5.6 | v12.8,10.36 11.73,9.3 C13.2 | v42.52,15.85 v42.52,12.95 | v37.19,28.04 33.38,28.04 32.46,28.96 IC6.5 | v56.54,53.65 56.54,52.27 59.13,49.68 v60.5,49.68
  Bottom 0.152: POWER.2 27.28,71.32 27.28,70.41 34.75,62.94 46.02,62.94 49.07,59.89 v51.97,59.89 51.97,58.22 v56.54,53.65 | v12.8,10.36 24.84,10.36 27.13,8.08 28.04,8.08 32.92,12.95 v42.52,12.95 48.01,12.95 57.45,22.4 57.45,22.55 61.11,26.21 61.11,40.69 60.5,41.3 v60.5,49.68 | v42.52,15.85 42.52,22.71 v37.19,28.04
+5V  (via drill 0.35)
  Top 0.152: U$1.25 63.25,2.59 63.25,3.66 63,3.9 63,5.8 61,7.8 58.4,7.8 55.63,10.57 55.63,11.28 37.8,11.28 36.58,12.5 PC2.+ 36.42,12.5 35.2,12.5 30.18,7.47 28.8,7.47 C11.2 28.65,7.47 28.65,7.92 v27.58,8.99 | RN1.8 48.77,32 49.38,32 RN1.7 49.53,32 50.14,32 RN1.6 50.14,31.85 50.75,31.24 51.36,31.24 51.51,31.09 51.51,29.57 53.8,27.28 53.8,24.23 54.41,23.62 55.02,23.62 55.93,24.54 | 55.93,24.54 56.84,25.45 56.84,25.76 C4.1 | RN4.6 11.89,16.76 12.5,16.76 RN4.5 12.65,16.76 13.56,16.76 v13.87,16.46 | 32.16,26.21 32.31,26.36 IC6.1 | 32.16,26.21 27.28,21.34 | 27.28,21.34 26.98,21.03 18.9,21.03 18.44,20.57 18.44,20.42 RN3.3 18.29,20.27 18.14,20.12 v18.14,18.75 | 32.16,26.21 32.92,25.45 33.53,25.45 34.14,26.06 34.14,26.36 IC6.3 34.29,26.52 34.75,26.98 42.06,26.98 IC2.2 | 32.16,26.21 IC6.1 | IC6.1 32.31,26.52 31.39,27.43 31.39,30.02 32.77,31.39 IC3.31 32.77,33.98 32.77,35.81 v32.92,35.97 | 55.93,24.54 57.76,22.71 57.76,19.36 55.17,16.76 29.87,16.76 27.74,14.63 27.13,14.63 26.82,14.94 26.82,15.54 27.58,16.31 27.89,16.31 28.5,16.92 28.5,20.12 27.28,21.34 | JP1.1 63.7,67.21 63.7,63.09 JP2.1 63.55,62.94 63.55,60.35 62.03,58.83 IC7.1 61.87,58.67 61.87,57 61.27,56.39 61.27,49.53 58.67,46.94 58.67,45.26 C5.1 | v50.29,40.69 51.97,40.69 IC4.4 | v50.29,42.82 52.43,42.82 IC4.32 | v45.57,40.69 45.26,40.69 45.11,40.84 44.35,40.84 IC3.61 44.2,40.84 43.43,40.84 43.28,41 43.28,48.62 48.62,53.95 48.62,57.3 49.38,58.06 IC5.8 49.38,58.22 49.38,60.81 47.55,62.64 47.55,64.92 7.2 | T2.2 12.65,36.27 13.26,36.27 18.59,30.94 20.12,30.94 21.49,32.31 IC1.2 21.64,32.46 21.64,38.56 IC1.4 21.49,38.71 17.68,38.71 14.78,41.6 14.78,42.22 12.34,44.65 12.34,47.4 C6.1 12.34,51.36 C9.1 12.19,51.51 12.19,51.97 8.38,55.78 v8.38,62.94
  Top 0.152: 3.2 6.25,65.23 6.25,71.48 12.2 | v29.57,43.74 29.11,43.28 28.35,43.28 IC3.10 | v28.8,49.68 30.18,49.68 IC3.100 | IC3.80 40.23,49.84 40.23,51.36 42.37,53.49 42.37,58.37 38.41,62.33 29.72,62.33 26.98,65.08 5.2 26.98,65.23 29.72,67.97 29.72,71.32 POWER.3
  Bottom 0.152: v13.87,16.46 15.85,16.46 17.68,18.29 | v18.14,18.75 17.68,18.29 | v27.58,8.99 27.13,8.99 24.84,11.28 22.4,11.28 18.29,15.39 18.29,17.68 17.68,18.29 | JP2.1 63.55,63.09 60.2,63.09 58.37,64.92 58.06,64.92 10.2 57.91,64.92 57.61,64.92 55.93,63.25 49.23,63.25 47.55,64.92 7.2 47.4,65.08 45.57,66.9 39.01,66.9 37.34,65.23 6.2 37.19,65.23 36.88,65.23 32.61,69.49 31.7,69.49 29.87,71.32 POWER.3 29.72,71.48 27.89,73.3 18.14,73.3 16.46,71.63 16.15,71.63 11.2 | v50.29,42.82 v50.29,40.69 v45.57,40.69 | 4.2 16.31,65.23 16.31,71.32 16.15,71.48 11.2 | 12.2 6.4,71.63 8.23,73.46 14.17,73.46 16,71.63 11.2 | 27.58,48.46 26.98,49.07 26.98,65.08 5.2 | 27.58,48.46 29.57,46.48 v29.57,43.74 29.57,40.08 32.92,36.73 v32.92,35.97 | 27.58,48.46 v28.8,49.68 | v8.38,62.94 6.25,65.08 3.2
AREF
  Top 0.152: C3.1 17.22,47.55 17.83,47.55 19.05,48.77 26.98,48.77 29.11,50.9 31.09,50.9 31.24,50.75 31.24,49.84 IC3.98
CMP  (via drill 0.35)
  Top 0.152: v13.87,22.71 13.87,21.79 RN5.7 | RN5.3 14.48,20.27 v14.48,19.51 14.48,19.05 17.07,16.46 20.73,16.46 22.86,14.33 27.89,14.33 30.02,16.46 55.32,16.46 58.83,19.96 | 58.83,19.96 59.44,20.57 59.44,26.36 58.67,27.13 58.67,29.26 C12.2 | v54.1,58.06 53.34,58.06 IC5.5 | v62.79,57.61 62.79,36.27 60.35,33.83 60.35,19.66 60.05,19.36 59.44,19.36 58.83,19.96
  Bottom 0.152: v13.87,22.71 13.87,20.12 v14.48,19.51 | v54.1,58.06 62.33,58.06 v62.79,57.61
D+  (via drill 0.35)
  Top 0.152: v27.43,15.24 28.8,16.61 28.8,20.42 31.55,23.16 44.5,23.16 45.11,23.77 45.11,24.08 48.31,27.28 50.44,27.28 50.9,26.82 50.9,26.67 RN2.5 | v24.08,11.89 23.16,10.97 Z2.2
  Bottom 0.152: v24.08,11.89 24.84,12.65 | 24.84,12.65 v27.43,15.24 | 24.84,12.65 28.19,9.3 28.19,8.69 27.89,8.38 27.28,8.38 24.69,10.97 8.69,10.97 3.81,15.85 3.81,24.54 2.13,26.21 2.13,31.09 6.71,35.66 6.71,36.73 X2.3
D-  (via drill 0.35)
  Top 0.152: v56.84,22.71 56.54,23.01 54.56,23.01 51.66,25.91 49.07,25.91 48.62,26.36 48.62,26.52 RN2.8 48.46,26.52 44.81,22.86 32.46,22.86 31.09,21.49 v30.79,21.49 | v60.5,40.39 60.5,41.45 Z1.2 | v20.12,28.19 20.12,27.43 19.05,26.36 16.46,26.36 16.31,26.52 16.31,28.19 8.84,35.66 8.84,36.73 X2.2
  Bottom 0.152: v56.84,22.71 56.84,30.48 60.5,34.14 v60.5,40.39 | v20.12,28.19 20.12,27.74 21.49,26.36 23.47,26.36 28.35,21.49 v30.79,21.49
DTR  (via drill 0.35)
  Top 0.152: v54.86,36.88 54.56,37.19 54.56,37.95 IC4.13 | v18.9,49.68 17.22,51.36 C7.1 | v13.56,52.58 12.19,53.95 12.19,56.08 UBOOT.1
  Bottom 0.152: v54.86,36.88 54.86,30.33 48.01,23.47 48.01,15.7 46.48,14.17 29.87,14.17 27.74,16.31 27.43,16.31 20.88,22.86 20.88,26.06 18.9,28.04 v18.9,49.68 16,52.58 v13.56,52.58
GATE_CMD  (via drill 0.35)
  Top 0.152: v14.48,38.1 14.48,36.42 T2.3 | v18.29,45.72 20.88,45.72 23.32,48.16 27.28,48.16 27.43,48.31 30.02,48.31 v30.18,48.16 | v50.14,56.54 50.14,57.61 50.6,58.06 IC5.7
  Bottom 0.152: v14.48,38.1 14.48,40.54 18.29,44.35 v18.29,45.72 | v30.18,48.16 30.18,53.19 38.71,61.72 46.33,61.72 50.14,57.91 v50.14,56.54
GND  (via drill 0.35, 0.5)
  Top 0.152: C4.2 58.67,25.91 56.84,27.74 56.84,29.26 C12.1 56.84,29.41 59.44,32 59.44,41.76 60.35,42.67 60.35,44.35 | 60.35,44.35 60.35,45.11 C5.2 | IC5.2 50.75,53.03 51.97,53.03 IC5.3 52.12,53.03 53.19,53.03 IC5.4 53.34,53.03 53.34,56.39 55.02,58.06 55.02,58.83 | 55.02,58.83 55.02,64.62 55.32,64.92 10.1 | 6.1 34.9,65.23 34.9,71.32 POWER.5 34.75,71.32 32.31,71.32 POWER.4 32.16,71.48 31.85,71.48 30.18,73.15 24.23,73.15 22.55,71.48 22.55,67.06 | v56.54,58.83 58.06,58.83 IC7.4 | v54.71,58.83 55.02,58.83 | 60.35,44.35 58.22,44.35 57.76,44.81 v57.76,50.14 | 6.86,10.97 13.11,10.97 17.53,6.55 22.1,6.55 22.86,7.32 C8.2 | 6.86,10.97 5.79,9.91 5.79,9.3 Y2.2 5.79,9.14 5.79,8.38 6.25,7.92 7.92,7.92 9.14,9.14 9.91,9.14 C13.1 10.06,9.14 13.26,5.94 25.45,5.94 26.82,7.32 C11.1 | 6.86,10.97 5.79,12.04 5.79,12.95 Y1.2 | C11.1 26.98,7.47 26.98,9.3 30.18,12.5 31.7,12.5 PC2.- 31.85,12.65 32.77,13.56 38.1,13.56 39.01,12.65 40.39,12.65 | U$1.24 60.66,2.59 60.66,3.66 61,4 61,4.4 59.6,5.8 59.6,6 57.22,8.38 31.55,8.38 29.87,6.71 27.58,6.71 26.98,7.32 C11.1 | 8.69,22.25 8.69,20.12 8.99,19.81 13.41,19.81 13.72,20.12 13.72,20.27 RN5.2 | 8.69,22.25 9.45,23.01 ON.C | 8.69,22.25 7.16,22.25 | 7.16,22.25 5.49,22.25 4.72,23.01 2.9,23.01 L.C | v8.38,43.43 12.95,38.86 14.63,38.86 19.2,34.29 19.2,32.46 IC1.1 | 7.16,22.25 7.16,32.46 5.64,33.98 5.64,40.54 5.94,40.84 5.94,45.87 X1.1 5.79,46.02 2.9,48.92 2.9,50.9 X1.3 2.9,51.05 2.9,64.47 3.5,65.08 3.1 3.66,65.23 3.66,71.48 12.1 3.81,71.63 4.12,71.63 5.94,73.46 11.58,73.46 13.41,71.63 11.1 | IC6.2 33.22,26.52 33.22,26.82 v32.46,27.58 31.7,28.35 31.7,29.87 33.07,31.24 33.07,32.77 33.22,32.92 33.22,33.83 IC3.32
  Top 0.152: 40.39,19.81 42.82,19.81 43.89,20.88 47.4,20.88 48.16,20.12 RESET.1 48.31,20.12 56.54,20.12 RESET.2 | 40.39,19.81 39.93,19.81 IC2.1 39.78,19.81 v38.1,21.49 | C14.1 18.14,42.06 15.7,42.06 C2.2 15.54,42.06 15.54,43.43 15.85,43.74 | 26.98,42.82 21.18,42.82 20.27,43.74 15.85,43.74 | 26.98,42.82 28.19,42.82 IC3.11 | 15.85,43.74 14.17,45.41 14.17,47.4 C6.2 14.17,47.55 14.17,51.36 C9.2 14.17,51.51 14.17,52.88 13.72,53.34 13.72,56.08 UBOOT.2 13.56,56.24 13.11,56.69 13.11,60.2 GROUND.2 13.11,60.35 v13.11,61.72 | IC4.EXP 54.25,40.39 53.49,41.15 52.12,41.15 IC4.3 51.97,41.15 51.66,41.15 51.51,41.3 v49.53,41.3 | v47.55,41.3 44.35,41.3 IC3.62 | 30.63,48.92 30.79,49.07 30.79,49.68 IC3.99 | 30.63,48.92 30.48,48.77 27.43,48.77 27.13,48.46 23.16,48.46 22.25,47.55 19.05,47.55 C3.2 | 25.6,54.41 25.76,54.56 31.55,54.56 C15.1 31.7,54.71 32.77,55.78 35.97,55.78 37.34,57.15 37.34,57.91 C17.2 37.49,58.06 38.86,58.06 39.47,58.67 40.84,58.67 41.6,57.91 C16.2 41.76,57.76 41.76,54.71 C1.2 41.6,54.56 41.6,53.19 39.78,51.36 IC3.81 39.78,49.68 39.78,49.07 | 25.6,54.41 25.6,58.37 JP4.1 | 25.6,54.41 JP3.1 | 30.63,48.92 30.79,48.92 30.94,48.77 39.47,48.77 39.78,49.07 | 39.78,49.07 v40.39,48.46 | 22.55,67.06 16,67.06 14.17,65.23 13.87,65.23 4.1 | 22.55,67.06 24.38,65.23 5.1 | 26.98,42.82 v26.98,40.08 | v40.39,15.85 40.39,12.65 | 40.39,19.81 v40.39,18.44 | 40.39,12.65 PC1.-
  Bottom 0.152: 6.1 34.9,65.08 35.2,65.08 37.03,63.25 43.28,63.25 44.96,64.92 7.1 45.11,64.92 47.09,62.94 49.84,62.94 53.95,58.83 v54.71,58.83 v56.54,58.83 62.48,58.83 63.4,57.91 63.4,57.3 57.76,51.66 v57.76,50.14 | v8.38,43.43 5.94,45.87 X1.1 | v38.1,21.49 32.46,27.13 v32.46,27.58 32.46,30.33 34.29,32.16 34.29,32.77 v26.98,40.08 | 11.1 13.56,71.48 13.72,71.32 13.72,65.23 4.1 13.72,65.08 13.11,64.47 v13.11,61.72 | v49.53,41.3 v47.55,41.3 47.55,43.74 42.82,48.46 v40.39,48.46 | 5.1 24.54,65.08 24.54,59.44 25.45,58.52 JP4.1 | v40.39,18.44 v40.39,15.85
  other vias: 59.4,61.2 22.2,56.4 21.8,67.6 11.2,72.6 38.6,47 56.6,49 35.8,68.8 53,67.2
  pour Bottom (isolate 0.016): -1.6,76.8 67.4,76.8 67.4,-2
  pour Top (isolate 0.016): -1.2,78.4 68.6,78.4 68.6,-2
  pour Bottom (isolate 0.016): -2.01,26.49 67.43,26.49 67.43,-2.01 -2.01,-2.01
M8RXD  (via drill 0.35)
  Top 0.152: v52.43,37.03 52.43,37.95 IC4.9 | v48.31,32.92 47.7,32.92 v46.18,31.39 | v46.18,14.78 46.18,14.17 47.24,13.11 v47.24,11.89 | v2.29,24.23 1.98,23.93 1.98,22.4 2.44,21.95 3.5,21.95 5.33,20.12 5.33,18.75 5.79,18.29 9.75,18.29 11.12,16.92 RN4.7
  Bottom 0.152: v48.31,32.92 v52.43,37.03 | v46.18,14.78 v46.18,31.39 | v47.24,11.89 32.77,11.89 28.19,7.32 7.77,7.32 3.2,11.89 3.2,23.32 v2.29,24.23
M8TXD  (via drill 0.35)
  Top 0.152: v50.6,38.56 51.97,38.56 IC4.8 | v44.5,32.46 v46.33,34.29 | v41.6,21.79 v43.13,21.79 | v24.84,19.81 21.03,19.81 17.98,16.76 17.37,16.76 16.46,17.68 v16.46,17.98 | v9.3,16.76 10.21,16.76 RN4.8
  Bottom 0.152: v46.33,34.29 v50.6,38.56 | v44.5,32.46 44.5,23.16 v43.13,21.79 | v41.6,21.79 38.25,18.44 32.46,18.44 31.09,19.81 v24.84,19.81 | v16.46,17.98 14.48,17.98 10.97,14.48 10.97,14.17 10.67,13.87 10.06,13.87 9.3,14.63 v9.3,16.76
N$2  (via drill 0.35)
  Top 0.152: v17.68,17.37 19.05,18.75 19.05,20.27 RN3.4 | v14.17,13.87 8.08,13.87 3.5,18.44 3.5,20.27 2.9,20.88 L.A
  Bottom 0.152: v14.17,13.87 v17.68,17.37
N$3
  Top 0.152: RN3.6 18.29,21.64 18.29,21.49 17.83,21.03 9.6,21.03 ON.A
N$5  (via drill 0.35)
  Top 0.152: v7.62,53.95 7.62,66.29 8.69,67.36 17.22,67.36 23.32,73.46 45.41,73.46 46.33,72.54 46.33,70.56 47.4,69.49 48.16,69.49 48.92,70.26 48.92,72.08 49.99,73.15 58.37,73.15 58.98,72.54 58.98,70.71 61.57,68.12 61.57,63.86 61.27,63.55 61.27,56.84 58.22,53.8 58.22,52.58 IC7.5 | v1.98,45.87 1.98,24.84 1.68,24.54 1.68,20.57 2.29,19.96 3.05,19.96 3.21,19.8 3.21,10.92 2.36,10.07 U$1.1 2.44,2.59
  Bottom 0.152: v7.62,53.95 7.62,53.49 5.64,51.51 5.64,49.53 v1.98,45.87
N$6  (via drill 0.35)
  Top 0.152: v59.28,50.44 59.28,52.43 IC7.6 | v22.86,8.53 v27.89,13.56 | U$1.2 5.03,2.59 5.03,3.66 5,3.69 5,5.4 6.4,6.8 7.8,6.8 8.93,7.92 v9.3,7.92
  Bottom 0.152: v59.28,50.44 59.28,33.83 55.32,29.87 55.32,22.1 46.79,13.56 v27.89,13.56 | v22.86,8.53 9.91,8.53 v9.3,7.92
N$7  (via drill 0.35)
  Top 0.152: v59.74,19.96 59.74,33.68 61.87,35.81 61.87,52.43 IC7.8 | U$1.3 7.47,2.59 7.47,3.66 7.6,3.79 7.6,5.6 8,6 v8.8,6
  Bottom 0.152: v59.74,19.96 56.24,19.96 44.96,8.69 30.02,8.69 26.98,5.64 9.16,5.64 v8.8,6
N$8  (via drill 0.35)
  Top 0.152: v60.66,50.6 60.66,52.43 IC7.7 | U$1.4 10.06,2.59 10.06,3.66 10.2,3.8 10.2,5.2 10.64,5.64 12.04,5.64 12.08,5.6 26.2,5.6 26.6,6 v29.4,6
  Bottom 0.152: v60.66,50.6 61.42,49.84 61.42,20.73 49.07,8.38 30.63,8.38 30.63,7.23 v29.4,6
N$54
  Top 0.152: RN4.4 12.65,15.54 13.87,15.54 14.48,16.15 14.48,16.76 11.73,19.51 8.38,19.51 7.01,20.88 6.25,20.88 RX.A
N$55
  Top 0.152: RN4.3 11.73,15.54 11.73,15.7 11.28,16.15 7.32,16.15 6.25,17.22 TX.A
PB7
  Top 0.152: RN3.5 19.2,21.79 19.2,23.47 23.01,27.28 24.23,27.28 30.18,33.22 30.18,33.83 IC3.26
PE0  (via drill 0.35)
  Top 0.152: v13.56,19.2 14.78,17.98 14.78,16 13.56,14.78 11.58,14.78 11.12,15.24 11.12,15.39 RN4.2 | v12.95,22.71 14.33,24.08 19.36,24.08 22.86,27.58 23.62,27.58 v23.93,27.89 | v25.45,46.33 26.52,46.33 27.43,47.24 28.19,47.24 IC3.2 28.35,47.4 v29.57,47.4 | v60.5,57 60.5,58.67 IC7.2
  Bottom 0.152: v13.56,19.2 13.56,22.1 v12.95,22.71 | v23.93,27.89 23.16,27.89 20.73,30.33 20.73,37.49 25.15,41.91 25.15,46.02 v25.45,46.33 | v60.5,57 60.5,56.69 56.84,53.03 55.47,53.03 46.48,62.03 38.56,62.03 29.57,53.03 v29.57,47.4
PE1  (via drill 0.35)
  Top 0.152: v10.36,14.48 10.36,15.39 RN4.1 | v17.53,25.3 18.44,25.3 20.73,27.58 20.73,30.02 v21.34,30.63 | v25.76,45.41 26.06,45.41 27.43,46.79 28.19,46.79 IC3.3 28.35,46.79 29.87,46.79 31.24,48.16 v37.03,48.16 | v59.44,57.15 59.44,58.67 IC7.3 | v49.38,50.29 49.38,49.23 v46.18,46.02
  Bottom 0.152: v10.36,14.48 17.53,21.64 v17.53,25.3 | v21.34,30.63 21.34,37.64 25.76,42.06 v25.76,45.41 | v59.44,57.15 59.74,57.15 60.2,57.61 60.81,57.61 61.11,57.3 61.11,55.63 55.47,49.99 49.68,49.99 v49.38,50.29 | v46.18,46.02 45.72,46.02 42.67,49.07 37.95,49.07 v37.03,48.16
PE3
  Top 0.152: IC3.5 28.35,45.87 39.62,45.87 42.82,49.07 42.82,58.37 38.56,62.64 32,62.64 29.57,65.08 5.3
PE5
  Top 0.152: IC3.7 28.19,44.81 17.83,44.81 14.94,47.7 14.94,60.81 10.67,65.08 8.84,65.08 3.3
PG5
  Top 0.152: IC3.1 28.19,47.85 23.47,47.85 20.73,45.11 17.98,45.11 16.15,46.94 16.15,62.33 18.9,65.08 4.3
PH3
  Top 0.152: IC3.15 28.35,40.84 29.72,40.84 30.18,41.3 42.52,41.3 42.98,41.76 42.98,48.77 43.13,48.92 43.13,61.87 39.93,65.08 6.3
PH4  (via drill 0.35)
  Top 0.152: v30.18,40.39 28.35,40.39 IC3.16 | v43.74,61.11 43.74,61.57 43.43,61.87 43.43,67.06 43.28,67.21 43.28,67.82 43.59,68.12 v46.94,68.12
  Bottom 0.152: v30.18,40.39 30.18,47.24 33.83,50.9 33.83,56.39 38.56,61.11 v43.74,61.11 | v46.94,68.12 49.99,65.08 7.3
PWRIN  (via drill 0.35)
  Top 0.152: v9.75,41.15 9.75,36.88 17.68,28.96 17.68,28.04 D1.A
  Bottom 0.152: v9.75,41.15 9.75,50.14 8.99,50.9 X1.2
RD+  (via drill 0.35)
  Top 0.152: v54.1,43.59 54.1,42.82 IC4.29 | v51.82,24.84 51.36,24.84 51.05,25.15 RN2.4
  Bottom 0.152: v54.1,43.59 54.1,38.56 55.47,37.19 55.47,30.48 51.82,26.82 v51.82,24.84
RD-  (via drill 0.35)
  Top 0.152: v53.49,44.35 53.49,42.82 IC4.30 | v55.93,22.4 51.21,22.4 48.46,25.15 RN2.1
  Bottom 0.152: v53.49,44.35 58.67,49.53 58.67,50.75 58.98,51.05 59.59,51.05 59.89,50.75 59.89,33.98 55.93,30.02 v55.93,22.4
RESET  (via drill 0.35)
  Top 0.152: 18.9,52.43 18.9,55.78 18.59,56.08 RESET-EN.1 | 18.9,52.43 18.9,51.51 C7.2 | 39.01,53.65 38.86,53.49 35.66,53.49 33.68,55.47 33.07,55.47 32.46,54.86 32.46,54.25 31.09,52.88 21.34,52.88 20.88,52.43 18.9,52.43 | 39.01,53.65 39.17,53.8 39.17,53.95 39.78,54.56 C1.1 | RESET-EN.2 17.07,56.08 18.44,56.08 RESET-EN.1 | POWER.1 24.69,71.32 24.69,67.06 25.45,66.29 25.45,64.01 18.59,57.15 18.59,56.24 RESET-EN.1 | v48.62,28.5 48.62,30.48 RN1.1 | v46.79,15.85 47.85,15.85 48.16,15.54 RESET.3 48.31,15.54 56.54,15.54 RESET.4 | v40.08,37.19 38.25,39.01 35.05,39.01 32.31,36.27 32.31,33.98 IC3.30 | v40.08,52.58 39.01,53.65
  Bottom 0.152: v46.79,15.85 46.79,24.84 48.62,26.67 v48.62,28.5 49.23,28.5 49.84,29.11 49.84,29.72 45.11,34.44 | v40.08,37.19 42.37,37.19 45.11,34.44 | v40.08,52.58 40.54,52.58 49.68,43.43 50.6,43.43 50.9,43.13 50.9,40.23 45.11,34.44
RXD1
  Top 0.152: IC3.45 39.78,33.98 39.78,35.97 40.69,36.88 40.69,37.49 38.86,39.32 34.44,39.32 23.01,27.89 22.71,27.89 19.2,24.38 14.02,24.38 7.77,30.63 7.77,44.04 8.53,44.81 8.53,47.4 6.1,49.84 6.1,62.79 7.32,64.01 7.32,66.45 10.52,69.65 19.05,69.65 23.16,73.76 45.57,73.76 47.85,71.48 COMMUNICATION.3
RXD2  (via drill 0.35)
  Top 0.152: v34.75,45.26 31.85,42.37 28.35,42.37 IC3.12 | v48.16,58.98 48.16,59.59 48.46,59.89 48.46,61.27 46.48,63.25 46.48,66.29 49.68,69.49 51.05,69.49 52.88,71.32 COMMUNICATION.5
  Bottom 0.152: v34.75,45.26 34.75,56.39 37.34,58.98 v48.16,58.98
RXD3
  Top 0.152: IC3.63 44.35,41.91 45.11,41.91 55.63,52.43 55.63,62.48 56.84,63.7 56.84,70.26 57.91,71.32 COMMUNICATION.7
RXL  (via drill 0.35)
  Top 0.152: v58.37,22.55 57.91,23.01 57.91,26.06 56.08,27.89 56.08,32.61 53.03,35.66 53.03,37.95 IC4.10 | v3.2,24.23 5.03,24.23 6.1,23.16 RX.C
  Bottom 0.152: v58.37,22.55 58.06,22.55 48.01,12.5 42.98,12.5 42.67,12.19 32.61,12.19 28.19,7.77 24.54,7.77 23.16,9.14 6.4,9.14 3.5,12.04 3.5,23.93 v3.2,24.23
SCL  (via drill 0.35)
  Top 0.152: v43.13,32.77 45.11,30.79 46.48,30.79 46.94,31.24 48.92,31.24 49.38,30.79 49.38,30.63 RN1.2 | IC3.43 38.71,33.98 v38.71,35.2 38.71,35.51 v35.81,38.41 | v41.6,60.5 38.71,63.4 38.71,66.29 42.67,70.26 42.67,71.32 COMMUNICATION.1
  Bottom 0.152: v43.13,32.77 41.15,32.77 v38.71,35.2 | v41.6,60.5 38.41,60.5 34.14,56.24 34.14,40.08 v35.81,38.41
SDA  (via drill 0.35)
  Top 0.152: v49.23,29.41 50.14,30.33 50.14,30.48 RN1.3 | v39.17,36.12 39.17,35.66 39.32,35.51 39.32,33.98 IC3.44 | v52.58,64.77 52.58,56.69 49.99,54.1 49.99,48.31 v45.57,43.89
  Bottom 0.152: v49.23,29.41 42.52,36.12 v39.17,36.12 38.71,36.12 37.8,35.2 37.19,35.2 36.88,35.51 36.88,36.12 37.19,36.42 37.64,36.42 45.11,43.89 v45.57,43.89 | v52.58,64.77 50.44,66.9 49.84,66.9 45.41,71.32 COMMUNICATION.2
TXD1  (via drill 0.35)
  Top 0.152: v35.51,32.46 39.78,32.46 40.23,32.92 40.23,33.83 IC3.46 | v33.53,63.25 35.05,63.25 36.27,64.47 36.27,67.06 42.37,73.15 43.13,73.15 44.2,72.08 44.2,70.26 45.26,69.19 48.31,69.19 50.44,71.32 COMMUNICATION.4
  Bottom 0.152: v35.51,32.46 26.67,41.3 26.67,63.25 25.91,64.01 25.91,66.29 26.67,67.06 29.87,67.06 33.53,63.4 v33.53,63.25
TXD2  (via drill 0.35)
  Top 0.152: v42.22,41.91 28.35,41.91 IC3.13 | v45.57,44.81 45.57,50.44 48.92,53.8 48.92,54.41 51.36,56.84 51.36,67.36 55.32,71.32 COMMUNICATION.6
  Bottom 0.152: v42.22,41.91 42.67,41.91 v45.57,44.81
TXD3  (via drill 0.35)
  Top 0.152: v56.24,67.06 56.54,66.75 56.54,63.86 55.32,62.64 55.32,52.58 45.11,42.37 44.35,42.37 IC3.64
  Bottom 0.152: v56.24,67.06 60.5,71.32 COMMUNICATION.8
TXL  (via drill 0.35)
  Top 0.152: v54.25,36.12 53.65,36.73 53.65,37.95 IC4.11 | v37.03,52.27 28.65,52.27 25.45,49.07 18.44,49.07 v17.83,48.46 | v7.47,19.51 6.25,19.51 TX.C
  Bottom 0.152: v54.25,36.12 54.25,37.95 52.88,39.32 52.88,44.35 39.78,57.45 39.17,57.45 38.86,57.15 38.86,56.54 50.14,45.26 50.14,44.65 49.84,44.35 49.23,44.35 40.39,53.19 37.95,53.19 v37.03,52.27 | v17.83,48.46 17.83,46.18 13.26,41.6 13.26,25.3 v7.47,19.51
UGND  (via drill 0.35)
  Top 0.152: v11.28,53.8 11.28,57.15 11.43,57.3 11.43,60.2 GROUND.1 | 55.17,43.59 54.56,42.98 54.56,42.82 IC4.28 | 55.17,43.59 56.39,43.59 57.76,42.22 57.76,33.53 58.67,32.61 C10.2 | v45.41,53.34 45.41,60.35 L1.1 45.26,60.5 43.89,61.87 v43.89,67.51 | 55.17,43.59 v53.49,45.26
  Bottom 0.152: X2.4 6.86,34.44 7.77,35.36 7.77,37.34 11.58,41.15 11.58,51.97 11.28,52.27 v11.28,53.8 11.28,55.63 4.88,62.03 4.88,72.85 6.1,74.07 37.34,74.07 v43.89,67.51 | v53.49,45.26 v45.41,53.34
USBVCC  (via drill 0.35)
  Top 0.152: v18.14,29.72 13.56,34.29 T2.1 | v21.95,12.65 21.95,8.08 21.34,7.47 C8.1 | v51.97,43.43 52.58,43.43 53.03,42.98 53.03,42.82 IC4.31 | v47.4,24.54 46.94,24.54 44.81,22.4 35.2,22.4 32.46,19.66 F1.1 32.31,19.51 32,19.2 v30.79,19.2 | v26.52,18.59 v25.15,17.22
  Bottom 0.152: v18.14,29.72 18.14,19.66 18.9,18.9 18.9,15.54 21.18,13.26 | 21.18,13.26 21.79,12.65 v21.95,12.65 | v51.97,43.43 51.97,38.41 53.03,37.34 53.03,30.18 v47.4,24.54 | v25.15,17.22 21.18,13.26 | v26.52,18.59 27.13,19.2 v30.79,19.2
USHIELD  (via drill 0.35)
  Top 0.152: v55.17,50.6 55.17,46.94 58.52,43.59 58.52,41.6 Z1.1 | v47.55,58.22 47.55,60.35 L1.2 47.4,60.5 47.4,61.87 46.02,63.25 46.02,66.29 v44.81,67.51 | v18.75,13.26 21.03,10.97 Z2.1 | X2.P$1 4.12,41.45 4.12,29.72 X2.P$2 | v3.66,53.95 5.79,51.82 5.79,49.23 v6.1,48.92
  Bottom 0.152: v47.55,58.22 v55.17,50.6 | v18.75,13.26 6.86,13.26 4.12,16 4.12,29.57 X2.P$2 | v44.81,67.51 42.82,69.49 42.37,69.49 37.49,74.37 4.27,74.37 2.59,72.69 2.59,55.02 v3.66,53.95 | v6.1,48.92 6.71,48.92 8.99,46.63 8.99,43.13 7.47,41.6 4.12,41.6 X2.P$1
VIN  (via drill 0.35)
  Top 0.152: v44.5,17.37 44.5,17.83 | 44.5,17.83 44.5,19.66 IC2.3 | v44.5,14.78 44.5,13.26 45.11,12.65 PC1.+ | v14.63,23.47 14.63,21.79 RN5.6 | v14.63,26.06 14.63,26.67 13.41,27.89 D1.C | v13.87,39.47 13.87,41.91 C2.1 13.72,42.06 v12.34,43.43 | v16.15,43.13 20.42,43.13 23.93,39.62 23.93,32.46 IC1.3 24.08,32.31 v25.15,31.24 | 44.5,17.83 39.32,17.83 v37.8,19.36
  Bottom 0.152: v44.5,14.78 v44.5,17.37 | v14.63,23.47 v14.63,26.06 13.87,26.82 v13.87,39.47 13.87,40.39 16.15,42.67 v16.15,43.13 | v12.34,43.43 12.34,55.02 5.18,62.18 5.18,72.69 6.25,73.76 34.75,73.76 37.03,71.48 37.34,71.48 POWER.6 | v37.8,19.36 37.34,19.36 33.07,23.62 27.13,23.62 25.15,25.6 v25.15,31.24
VUCAP
  Top 0.152: IC4.27 55.02,42.82 55.02,42.98 55.32,43.28 56.24,43.28 57.15,42.37 57.15,32.77 57,32.61 C10.1
XT1  (via drill 0.35)
  Top 0.152: v29.72,15.24 29.72,12.65 23.32,6.25 13.56,6.25 10.97,8.84 10.97,9.3 10.21,10.06 9.6,10.06 8.84,9.3 6.86,9.3 Y2.3 | 39.01,57.3 39.47,57.76 39.78,57.76 C16.1 | 39.01,57.3 36.42,54.71 35.81,54.71 R2.1 | v53.65,30.48 54.71,29.41 R4.2 | 39.01,57.3 v39.47,56.84 | v41.91,20.88 43.43,20.88 44.65,22.1 45.87,22.1 v47.4,23.62
  Bottom 0.152: 29.72,15.7 v29.72,15.24 | 29.72,15.7 27.74,17.68 Q1.2 | v39.47,56.84 52.58,43.74 52.58,39.17 53.65,38.1 v53.65,30.48 53.65,29.87 v47.4,23.62 | 29.72,15.7 36.73,15.7 v41.91,20.88
XT1R  (via drill 0.35)
  Top 0.152: v50.44,44.04 49.68,43.28 49.68,42.52 49.99,42.22 51.97,42.22 IC4.1 | v50.9,36.42 50.9,33.07 52.88,31.09 52.88,29.41 R4.1
  Bottom 0.152: v50.44,44.04 51.21,43.28 51.21,36.73 v50.9,36.42
XT2  (via drill 0.35)
  Top 0.152: v5.64,10.82 4.88,10.06 4.88,9.3 Y2.1 | v15.24,9.75 15.24,10.67 v20.42,15.85 | v49.53,44.96 49.38,44.81 49.38,42.37 50.14,41.6 51.97,41.6 IC4.2 | v38.56,54.1 37.95,54.1 37.49,54.56 R2.2 | v36.42,57.15 35.66,57.91 C17.1 | v27.28,20.42 24.69,17.83 22.71,17.83 Q1.1
  Bottom 0.152: v5.64,10.82 8.38,10.82 9.45,9.75 v15.24,9.75 | v20.42,15.85 20.73,15.85 22.55,17.68 Q1.1 | v49.53,44.96 49.07,44.96 39.93,54.1 v38.56,54.1 38.25,54.41 | v36.42,57.15 36.42,56.24 38.25,54.41 | v27.28,20.42 35.81,20.42 37.49,18.75 38.1,18.75 38.71,19.36 38.71,25.6 36.42,27.89 36.42,52.58 38.25,54.41
XTAL1  (via drill 0.35)
  Top 0.152: R1.1 53.03,32.46 55.47,30.02 55.47,28.8 54.86,28.19 54.86,25.91 R3.2 54.71,25.76 v54.71,24.23 | v19.96,40.39 19.96,41.91 C14.2 | v19.51,15.85 16.76,13.11 6.86,13.11 Y1.3 | v20.27,22.71 22.4,24.84 Q2.2
  Bottom 0.152: v19.96,40.39 19.96,28.96 19.51,28.5 19.51,27.89 22.4,24.99 Q2.2 | 19.51,19.2 19.51,21.95 v20.27,22.71 | 19.51,19.2 v19.51,15.85 | v54.71,24.23 54.71,21.95 46.63,13.87 29.72,13.87 27.58,16 27.28,16 24.08,19.2 19.51,19.2
XTAL1R
  Top 0.152: R3.1 53.03,25.91 52.58,25.91 50.6,27.89 47.55,27.89 43.59,31.85 35.2,31.85 34.29,32.77 34.29,33.83 IC3.34
XTAL2  (via drill 0.35)
  Top 0.152: v48.77,39.01 49.23,39.01 54.71,33.53 54.71,32.61 R1.2 | v37.49,35.81 34.9,35.81 33.83,34.75 33.83,33.98 IC3.33 33.68,33.83 v33.68,32.46 | v26.06,50.6 28.04,52.58 31.39,52.58 33.38,54.56 C15.2 | v4.88,16.15 4.88,13.11 Y1.1
  Bottom 0.152: v48.77,39.01 40.69,39.01 v37.49,35.81 | 26.36,32.46 26.36,26.21 27.58,24.99 Q2.1 | 26.36,32.46 26.36,45.72 26.06,46.02 v26.06,50.6 23.01,53.65 13.72,53.65 12.95,52.88 12.95,35.81 4.88,27.74 v4.88,16.15 | 26.36,32.46 v33.68,32.46
XVCC  (via drill 0.35)
  Top 0.152: v21.34,27.43 18.59,24.69 17.22,24.69 16,25.91 16,28.04 9.75,34.29 8.84,34.29 X2.1 | v34.75,21.03 36.12,19.66 F1.2
  Bottom 0.152: v21.34,27.43 22.86,27.43 28.19,22.1 33.68,22.1 v34.75,21.03

### Text on the board
tNames: MADE BY: VEDANT SANIL | PRATIK BHUJBAL | BHUVAN BHARDWAJ | TEAM SRMAUV